# Altium project Longboard_32bit.PrjPCB (part 4 of 6)

## Sheet DC_Power_Regulation.SchDoc: STM32F446 CNC
size B; Author: AM; CompanyName: Expatria Technologies; DrawnBy: A.Marles; Engineer: AM; Organization: Expatria Technolgoies; Address1: PO Box 2084; Address3: Merritt, BC V1K 1B8; Address4: Canada; DocumentNumber: 23; Revision: B6; SheetNumber: 20; SheetTotal: 26
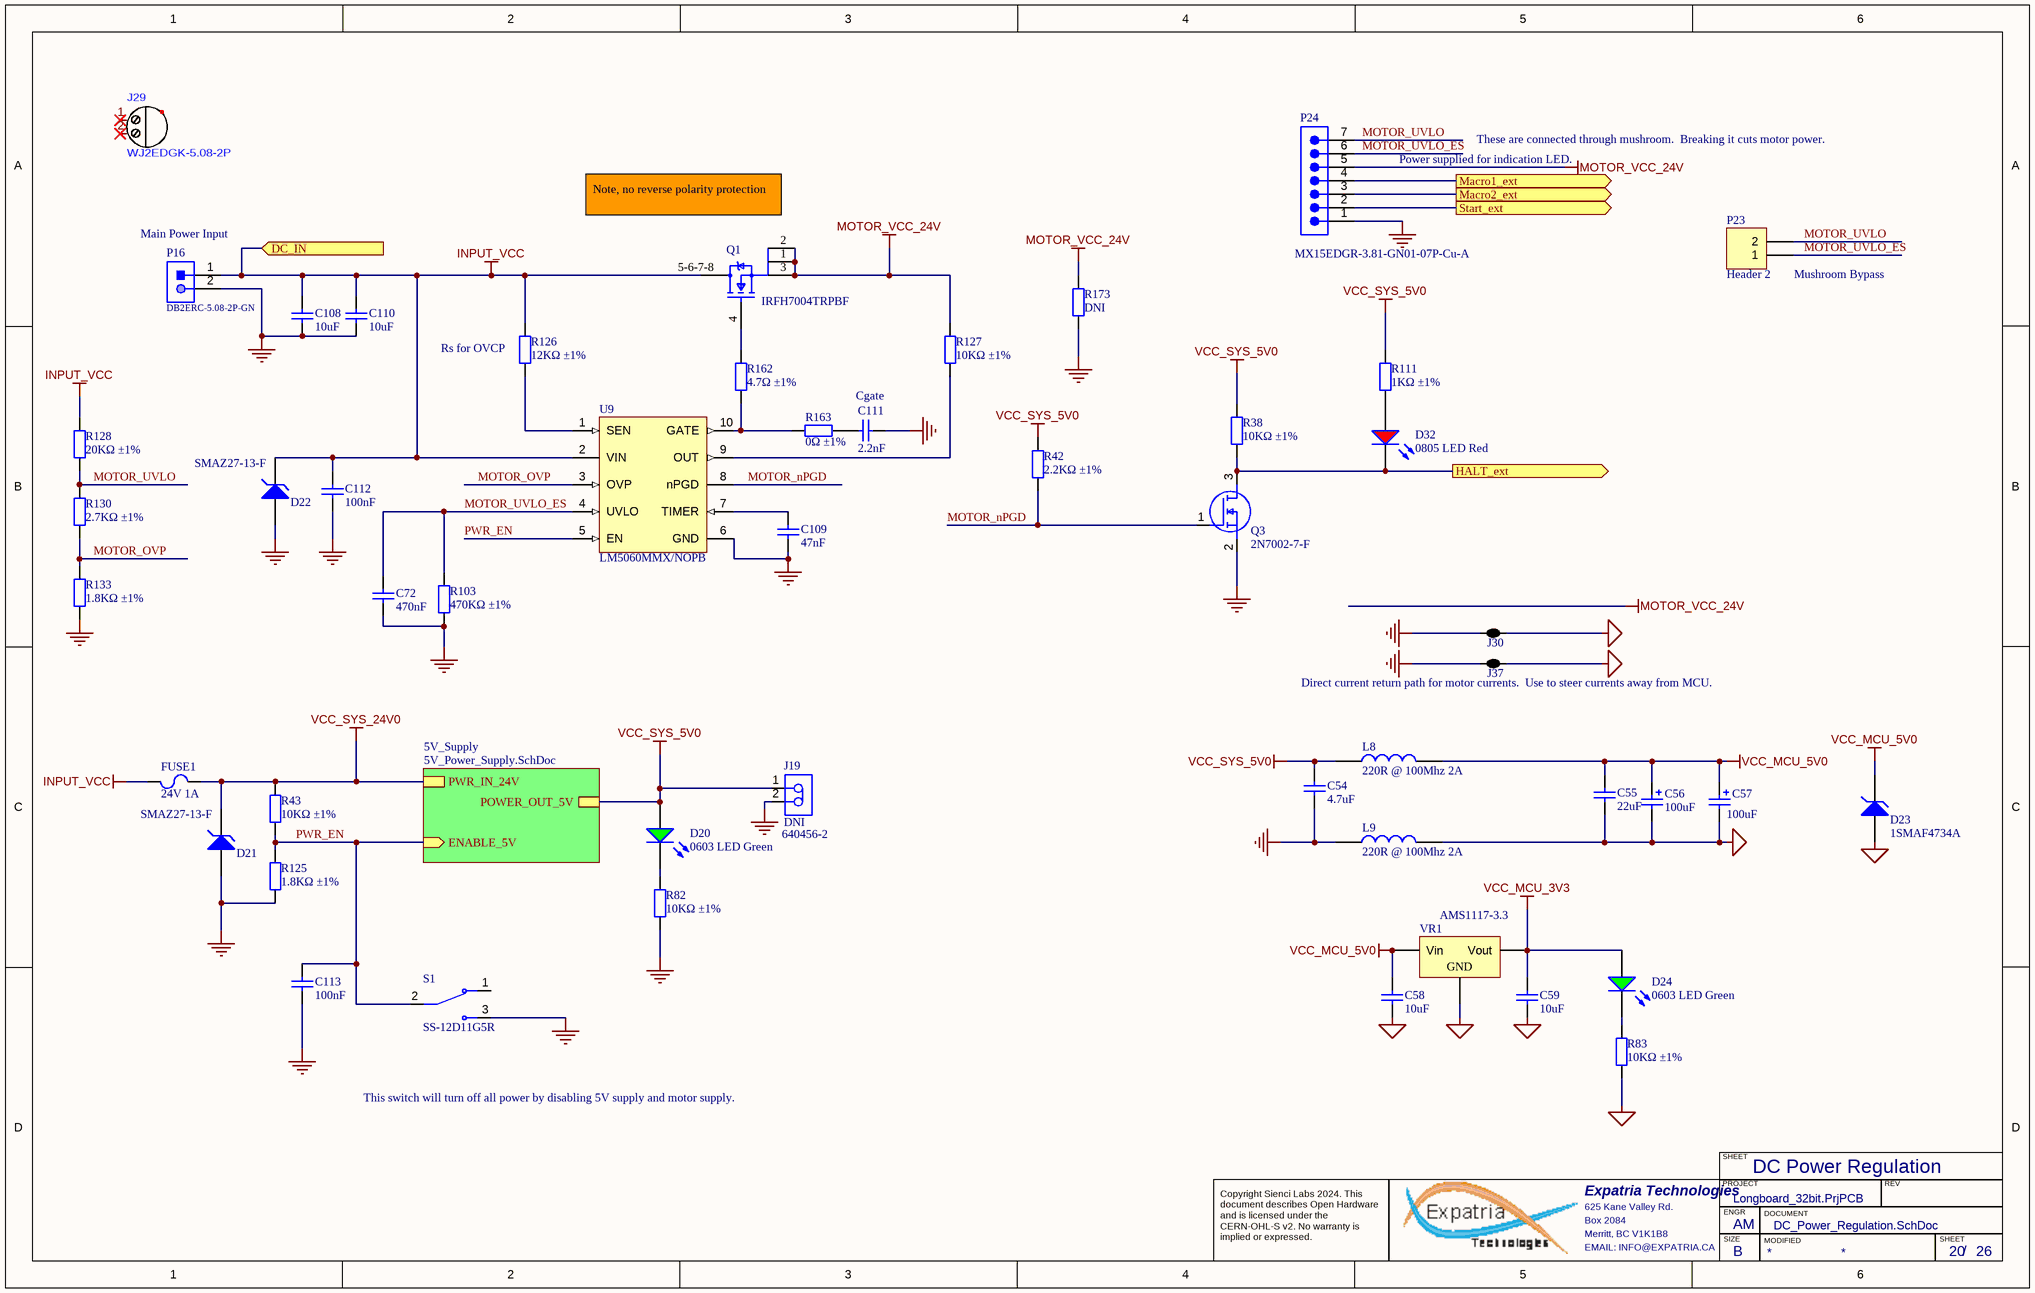
[diagram p12: DC_Power_Regulation.SchDoc]

### Parts
C54  4.7uF  [0603_C]
C55  22uF  [0805_C]
C56  100uF  [CASE-B_3528]
C57  100uF  [WCAP-ASLI_D6.3H7.7]
C58  10uF  [1206_C]
C59  10uF  [1206_C]
C72  470nF  [0603_C]
C108  10uF  [1206_C]
C109  47nF  [0603_C]
C110  10uF  [1206_C]
C111  2.2nF  [0402_C]
C112  100nF  [0603_C]
C113  100nF  [0603_C]
D20  0603 LED Green  [0603_LED_S1 - GREEN]
D21  SMAZ27-13-F  [DIOM5226X240N]
D22  SMAZ27-13-F  [DIOM5226X240N]
D23  1SMAF4734A  [DIOM5226X240N]
D24  0603 LED Green  [0603_LED_S1 - GREEN]
D32  0805 LED Red  [0805_LED_S1 - RED]
FUSE1  24V 1A  [1206_C]
J19  DNI  value 640456-2  [TECO-640456-2_V]
J29  WJ2EDGK-5.08-2P  (mechanical)
J30  2 way net tie junction  [2way_HP]  (value not drawn)  (net tie, no BOM)
J37  2 way net tie junction  [2way_HP]  (value not drawn)  (net tie, no BOM)
L8  220R @ 100Mhz 2A  [0805_R]
L9  220R @ 100Mhz 2A  [0805_R]
P16  DB2ERC-5.08-2P-GN  [CONN-TH_2P-P5.08_DB2ERC-5.08-2P]
P23  Header 2  [HDR1X2]
P24  MX15EDGR-3.81-GN01-07P-Cu-A  [691322310007]
Q1  IRFH7004TRPBF  [FP-PG-TDSON-8-MFG]
Q3  2N7002-7-F  [SOT-23(SOT-23-3)]
R38  10KΩ ±1%  [0603_R]
R42  2.2KΩ ±1%  [0603_R]
R43  10KΩ ±1%  [0603_R]
R82  10KΩ ±1%  [0603_R]
R83  10KΩ ±1%  [0603_R]
R103  470KΩ ±1%  [0603_R]
R111  1KΩ ±1%  [0603_R]
R125  1.8KΩ ±1%  [0603_R]
R126  12KΩ ±1%  [0603_R]
R127  10KΩ ±1%  [0603_R]
R128  20KΩ ±1%  [0603_R]
R130  2.7KΩ ±1%  [0603_R]
R133  1.8KΩ ±1%  [0603_R]
R162  4.7Ω ±1%  [0603_R]
R163  0Ω ±1%  [0603_R]
R173  DNI  [0603_R]  (no BOM)
S1  SS-12D11G5R  [SW_500SSP1S1M6QEA]
U9  LM5060MMX/NOPB  [DGS0010A_N]
VR1  AMS1117-3.3  [SOT-223]

### Sub-sheets
5V_Supply = 5V_Power_Supply.SchDoc: POWER_OUT_5V, PWR_IN_24V, ENABLE_5V (in)

### Ports
DC_IN (in), HALT_ext (out), Macro1_ext (out), Macro2_ext (out), Start_ext (out)

### Nets
GND: C54.1 C72.1 C108.1 C109.1 C110.1 C111.1 C112.1 C113.1 D21.1(A) D22.1(A) J19.2 J30.1 J37.1 L9.1 P16.2 P24.1 Q3.2(S) R82.1 R103.1 R125.1 R133.1 R173.1 S1.3(NO) U9.6(GND)
INPUT_VCC: C108.2 C110.2 C112.2 D22.2(K) FUSE1.1 P16.1 Q1.5-6-7-8(D) R126.2 R128.2 U9.2(VIN) ; port DC_IN
MCU_GND: C55.1 C56.2 C57.2(N) C58.1 C59.1 D23.1(A) J30.2 J37.2 L9.2 R83.1 VR1.1(GND)
MOTOR_VCC_24V: P24.5 Q1.1(S) Q1.2(S) Q1.3(S) R127.2 R173.2
VCC_MCU_3V3: C59.2 D24.A VR1.2(Vout)
VCC_MCU_5V0: C55.2 C56.1 C57.1(P) C58.2 D23.2(K) L8.2 VR1.3(Vin)
VCC_SYS_5V0: C54.2 D20.A J19.1 L8.1 R38.2 R42.2 R111.2 ; sheet 5V_Supply/POWER_OUT_5V
VCC_SYS_24V0: D21.2(K) FUSE1.2 R43.2 ; sheet 5V_Supply/PWR_IN_24V
HALT_ext: D32.K Q3.3(D) R38.1 ; port HALT_ext
Macro1_ext: P24.4 ; port Macro1_ext
Macro2_ext: P24.3 ; port Macro2_ext
MOTOR_nPGD: Q3.1(G) R42.1 U9.8(nPGD)
MOTOR_OVP: R130.1 R133.2 U9.3(OVP)
MOTOR_UVLO: P23.2 P24.7 R128.1 R130.2
MOTOR_UVLO_ES: C72.2 P23.1 P24.6 R103.2 U9.4(UVLO)
PWR_EN: C113.2 R43.1 R125.2 S1.2(COM) U9.5(EN) ; sheet 5V_Supply/ENABLE_5V
Start_ext: P24.2 ; port Start_ext
NetC109_2: C109.2 U9.7(TIMER)
NetC111_2: C111.2 R163.1
NetD20_K: D20.K R82.2
NetD24_K: D24.K R83.2
NetD32_A: D32.A R111.1
NetQ1_4: Q1.4(G) R162.2
NetR126_1: R126.1 U9.1(SEN)
NetR127_1: R127.1 U9.9(OUT)
NetR162_1: R162.1 R163.2 U9.10(GATE)

Not connected (* = marked no-connect by the designer): J29 1* 2*; S1 1(NC)

### Notes on the sheet
- Power supplied for indication LED.
- These are connected through mushroom.  Breaking it cuts motor power.
- (near P16) Main Power Input
- (near Q1) Note, no reverse polarity protection
- (near P23) Mushroom Bypass
- (near R126) Rs for OVCP
- Cgate
- (near J37) Direct current return path for motor currents.  Use to steer currents away from MCU.
- This switch will turn off all power by disabling 5V supply and motor supply.
- DC Power Regulation
- SHEET
- Expatria Technologies
- 625 Kane Valley Rd.
- Box 2084
- Merritt, BC V1K1B8
- PROJECT
- SIZE
- ENGR
- MODIFIED
- DOCUMENT
- REV
- Copyright Sienci Labs 2024. This document describes Open Hardware and is licensed under the CERN-OHL-S v2. No warranty is implied or expressed.
- EMAIL: INFO@EXPATRIA.CA
- B
- /

### Library data of the parts
C54 = 0603 4.7uF (475) 10% 16V: as C124 on sheet Ethernet_Interface; ComponentLink1Description: Supplier link; ComponentLink1URL: http://www.szlcsc.com/product/details_20375.html; Package: 0603; Supplier: LC; SuppliersPartNumber: C19666; Capacitance: 4.7uF; Tolerance: 10%; Voltage: 16V
C55 = 0805 22uF (226) 20% 25V: as C8 on sheet RS485; ComponentLink1Description: Supplier link; ComponentLink1URL: http://www.szlcsc.com/product/details_46786.html; Package: 0805; Supplier: LC; SuppliersPartNumber: C45783; Capacitance: 22uF; Tolerance: 20%; Voltage: 25V
C56 = 3528 100uF (107) 10% 6.3V: Tantalum capacitor; Manufacturer: AVX; PartNumber: TAJB107K006RNJ; Tolerance: 10%; Voltage: 6.3V; ComponentLink1Description: Supplier link; ComponentLink1URL: http://www.szlcsc.com/product/details_16815.html; Package: 3528; Supplier: LCSC; SuppliersPartNumber: C16133; Capacitance: 100uF; Manufacturer Part Number: TAJB107K006RNJ
C57 = 865080445010: -45℃~+105℃ 2000hrs@105℃ 100uF 7.7mm 35V 6.3mm ±20% SMD,6.3x7.7mm Aluminum Electrolytic Capacitors - SMD ROHS; Manufacturer: Capxon International Elec; Manufacturer Part Number: HV101M035E077ETR; SuppliersPartNumber: C59934; Value: 100uF; Supplier: LCSC
C58 C59 C108 C110 = 1206 10uF (106) 10% 50V: 50V 10uF X5R ±10% 1206 Multilayer Ceramic Capacitors MLCC - SMD/SMT ROHS; Manufacturer: Samsung Electro-Mechanics; Manufacturer Part Number: CL31A106KBHNNNE; Package: 1206; Supplier: LC; SuppliersPartNumber: C13585; Capacitance: 10uF; Tolerance: 10%; Voltage: 50V
C72 = 0603 470nF (474) 10% 25V: Chip capacitors; Manufacturer: Samsung Electro-Mechanics; PartNumber: CL10B474KA8NNNC; Tolerance: 10%; Voltage: 25V; ComponentLink1Description: Supplier link; ComponentLink1URL: http://www.szlcsc.com/product/details_1975.html; Package: 0603; Supplier: LC; SuppliersPartNumber: C1623; Capacitance: 470nF
C109 = 0603 47nF (473) 10% 50V: Chip capacitors; Manufacturer: Samsung Electro-Mechanics; PartNumber: CL10B473KB8NNNC; Tolerance: 10%; Voltage: 50V; ComponentLink1Description: Supplier link; ComponentLink1URL: http://www.szlcsc.com/product/details_1974.html; Package: 0603; Supplier: LC; SuppliersPartNumber: C1622; Capacitance: 47nF
C111 = 0402 2.2nF (222) 10% 50V: Chip capacitor; Manufacturer: Guangdong Fenghua Advanced Tech; PartNumber: 0402B222K500NT; Tolerance: 10%; Voltage: 50V; ComponentLink1Description: Supplier link; ComponentLink1URL: http://www.szlcsc.com/product/details_1883.html; Package: 0402; Supplier: LC; SuppliersPartNumber: C1531; Capacitance: 2.2nF
C112 C113 = 0603 100nF (104) 10% 50V: as C4 on sheet Spindle_Control; ComponentLink1Description: Supplier link; ComponentLink1URL: http://www.szlcsc.com/product/details_15331.html; Package: 0603; Supplier: LC; SuppliersPartNumber: C14663; Capacitance: 100nF; Tolerance: 10%; Voltage: 50V
D20 D24 = 19-217/GHC-YR1S2/3T: as D18 on sheet RS485; Package: 0603; Supplier: LC; SuppliersPartNumber: C72043; Color: Green; Manufacturer Part Number: 19-217/GHC-YR1S2/3T
D21 D22 = BZT52C27: 27V ±5% 1W 500nA @ 20.5V SMA(DO-214AC) Zener Diodes RoHS; Manufacturer: Diodes Incorporated; ComponentLink1Description: 供应商链接; ComponentLink1URL: http://www.szlcsc.com/product/details_8541.html; Package: SMA(DO-214AC); Supplier: LCSC; SuppliersPartNumber: C155318; Manufacturer Part Number: SMAZ27-13-F
D23 = BZT52C27: 27V ±5% 1W 500nA @ 20.5V SMA(DO-214AC) Zener Diodes RoHS; Manufacturer: Shandong Jingdao Microelectronics; ComponentLink1Description: 供应商链接; ComponentLink1URL: http://www.szlcsc.com/product/details_8541.html; Package: SMAF; Supplier: LCSC; SuppliersPartNumber: C169539; Manufacturer Part Number: 1SMAF4734A
D32 = 0805 LED Red: Red 0805 Light Emitting Diodes (LED) ROHS; Manufacturer: Foshan NationStar Optoelectronics; Manufacturer Part Number: NCD0805R1; Package: 0805; Supplier: LC; SuppliersPartNumber: C84256; Color: Red
FUSE1 = JK-nSMD050-24: 24V 1A 0.1s 1206 PTC Resettable Fuses RoHS; Manufacturer: Jinrui Electronic Materials Co.; Package: 1206; Supplier: LCSC; SuppliersPartNumber: C369160; PartNumber: JK-nSMD050-24; Manufacturer Part Number: JK-nSMD050-24
J19 = CMP-2000-05417-1: Male Header, Pitch 2.54 mm, 1 x 2 Position, Height 10.49 mm, Tail Length 3.556 mm, -55 to 105 degC, RoHS, Bulk; Manufacturer: TE Connectivity; Standards: RoHSCompliant,ELVCompliant,UL94V-0; Material, Housing: Polyester; Agency Approvals: CSA,UL; Brand/Series: MTA-100Series; Contact Centerline Spacing: 0.100 / in.; Material, Contact: CopperAlloy; Current, Rating: 5 / A; Color, Housing: White; Contact Termination Area Plating: Tin; Special Features: Pinstrip; Number of Positions: 2; Pin Spacing: 0.1 / "; Temperature, Operating: -55to+105 / degC; Angle: Straight; Mount Angle: Vertical; Connector Type: MTA-100; Primary Type: InterconnectSystem; Voltage, Rating: 250 / V; Mounting Hole Size: 0.04 / "; Number of Rows: 1; Termination: Solder; Length, Terminal Post: 0.14 / in.; Manufacturer URL: http://www.te.com/; Color: White; Size, Post: 0.025 / in.; Contact Shape: Square; Mounting Type: PCMount; Datasheet URL: https://datasheet.ciiva.com/11746/0900766b80eb7fdd-11746365.pdf; Type: PCBPlug; Datasheet Version: Rev. W, 06/2004; Number of Contacts: 2; Flammability Rating: UL94V-0; Contact Plating: Tin; Length, Pin: 0.14 / "; Contact Mating Area Plating: Tin; Length, Overall: 0.2 / "; SuppliersPartNumber: C86502
J29 = WJ2EDGK-5.08-2P: 5.08mm Green Plug P=5.08mm Pluggable System Terminal Block ROHS; Manufacturer: Kangnex; Supplier: LCSC; Supplier Part Number 1: C71370; Manufacturer Part Number: WJ2EDGK-5.08-2P; RoHS: No; SuppliersPartNumber: C71370
J30 J37 = 2way: ComponentLink1URL: http://www.edatools.cz/addons; ComponentLink1Description: Source; FootprintNote: LP=12mil, MP=40mil, HP=120mil
L8 L9 = CBW201209U221T: as L6 on sheet Ethernet_Interface; Manufacturer Part Number: CBW201209U221T; Package: 0402; Supplier: LC; SuppliersPartNumber: C139188
P16 = DB2ERC-5.08-2P-GN: 320V 20A 2 Bend -40℃~+105℃ 1 5.08mm 1x2P Green Board Edge/Receptacle-Close Push-Pull,P=5.08mm Pluggable System Terminal Block ROHS; Manufacturer: Dibo; Supplier 1: LCSC; Supplier Part Number 1: C395737; Manufacturer Part Number: DB2ERC-5.08-2P-GN; RoHS: Yes; Category: Terminals; SuppliersPartNumber: C395737
P23 = Header 2: Straight Square Pins 2 2.54mm Black Brass 1x2P Plugin,P=2.54mm Pin Headers ROHS; Manufacturer: MOLEX; Manufacturer Part Number: 22284020; Publisher: Altium Limited; LatestRevisionDate: 17-Jul-2002; LatestRevisionNote: Re-released for DXP Platform.; SuppliersPartNumber: C234182; Supplier 1: LCSC; Supplier Part Number 1: C234182
P24 = MX15EDGR-3.81-GN01-07P-Cu-A: 300V 8A 7 Bend -40℃~+105℃ 1 3.81mm 1x7P Green Board Edge/Receptacle-Close Push-Pull,P=3.81mm Pluggable System Terminal Block ROHS; Manufacturer: MAX; Manufacturer Part Number: MX15EDGR-3.81-GN01-07P-Cu-A; SuppliersPartNumber: C5188162
Q1 = IRFH7004TRPBF: MOSFET N-CH 40V 100A 8PQFN; Rds On Max: 1.4mR; Threshold Voltage: 3V; Input Capacitance: 6.419nF; Max Power Dissipation: 156W; SuppliersPartNumber: C112334; Max Operating Temperature: 150°C; Min Operating Temperature: -55°C; Case/Package: VQFN; Packaging: Cut Tape; RoHS Compliant: Yes; Continuous Drain Current (ID): 100A; Reach SVHC Compliant: Yes; Number of Pins: 5; Mount: Surface Mount; Lead Free: Lead Free; Series: HEXFET®, StrongIRFET™; Max Dual Supply Voltage: 40V; Halogen Free: Halogen Free; Drain to Source Voltage (Vdss): 40V
Q3 = 2N7002-7-F: as Q4 on sheet Spindle_Control; SuppliersPartNumber: C85049; Manufacturer Part Number: 2N7002-7-F; Value: 2N7002-7-F; Datasheet Link: https://datasheet.datasheetarchive.com/originals/distributors/SFDatasheet-0/sf-0003625.pdf; Height: 1.2mm; Manufacturer_Part_Number: 2N7002-7-F; Mouser Part Number: 621-2N7002-F; Mouser Price/Stock: https://www.mouser.co.uk/ProductDetail/Diodes-Incorporated/2N7002-7-F?qs=jMXWnm70%252BC%252BAX%252BMLzUkTZg%3D%3D; Arrow Part Number: 2N7002-7-F; Arrow Price/Stock: https://www.arrow.com/en/products/2n7002-7-f/diodes-incorporated?region=nac
R38 R43 R82 R83 R127 = 0603 10K (1002) 1%: Chip resistor; Manufacturer: Uniroyal Elec; PartNumber: 0603WAF1002T5E; Power: 1/10W; ComponentLink1Description: Supplier link; ComponentLink1URL: http://www.szlcsc.com/product/details_26547.html; Package: 0603; SuppliersPartNumber: C25804; Resistance: 10KΩ; Tolerance: 1%
  R38: Supplier: LC; Manufacturer Part Number: 0603WAF1002T5E
  R43 R82 R83: Supplier: LCSC; Manufacturer Part Number: 0603WAF1002T5E
  R127: Supplier: LC
R42 = 0603 2.2K (2201) 1%: Chip resistor; Manufacturer: Uniroyal Elec; PartNumber: 0603WAF2201T5E; Power: 1/10W; ComponentLink1Description: Supplier link; ComponentLink1URL: http://www.szlcsc.com/product/details_4597.html; Package: 0603; Supplier: LC; SuppliersPartNumber: C4190; Resistance: 2.2KΩ; Tolerance: 1%; Manufacturer Part Number: 0603WAF2201T5E
R103 = 0603 470K (4703) 1%: Chip resistor; Manufacturer: Uniroyal Elec; PartNumber: 0603WAF4703T5E; Power: 1/10W; ComponentLink1Description: Supplier link; ComponentLink1URL: http://www.szlcsc.com/product/details_23905.html; Package: 0603; Supplier: LC; SuppliersPartNumber: C23178; Resistance: 470KΩ; Tolerance: 1%
R111 = 0603 1K (1001) 1%: Chip resistor; Manufacturer: Uniroyal Elec; PartNumber: 0603WAF1001T5E; Power: 1/10W; ComponentLink1Description: Supplier link; ComponentLink1URL: http://www.szlcsc.com/product/details_21904.html; Package: 0603; Supplier: LC; SuppliersPartNumber: C21190; Resistance: 1KΩ; Tolerance: 1%; Manufacturer Part Number: 0603WAF1001T5E
R125 R133 = 0603 1.8K (1801) 1%: Chip resistor; Manufacturer: Uniroyal Elec; PartNumber: 0603WAF1801T5E; Power: 1/10W; ComponentLink1Description: Supplier link; ComponentLink1URL: http://www.szlcsc.com/product/details_4584.html; Package: 0603; Supplier: LC; SuppliersPartNumber: C4177; Resistance: 1.8KΩ; Tolerance: 1%
  R125: Manufacturer Part Number: 0603WAF1801T5E
R126 = 0603 12K (1202) 1%: Chip resistor; Manufacturer: Uniroyal Elec; PartNumber: 0603WAF1202T5E; Power: 1/10W; ComponentLink1Description: Supplier link; ComponentLink1URL: http://www.szlcsc.com/product/details_23517.html; Package: 0603; Supplier: LC; SuppliersPartNumber: C22790; Resistance: 12KΩ; Tolerance: 1%
R128 = 0603 20K (2002) 1%: Chip resistor; Manufacturer: Uniroyal Elec; PartNumber: 0603WAF2002T5E; Power: 1/10W; ComponentLink1Description: Supplier link; ComponentLink1URL: http://www.szlcsc.com/product/details_4591.html; Package: 0603; Supplier: LC; SuppliersPartNumber: C4184; Resistance: 20KΩ; Tolerance: 1%
R130 = 0603 2.7K (2701) 1%: Chip resistor; Manufacturer: Uniroyal Elec; PartNumber: 0603WAF2701T5E; Power: 1/10W; ComponentLink1Description: Supplier link; ComponentLink1URL: http://www.szlcsc.com/product/details_13814.html; Package: 0603; Supplier: LC; SuppliersPartNumber: C13167; Resistance: 2.7KΩ; Tolerance: 1%
R162 = 0603 4.7R (4R70) 1%: Chip resistor; Manufacturer: Uniroyal Elec; PartNumber: 0603WAF470KT5E; Power: 1/10W; ComponentLink1Description: Supplier link; ComponentLink1URL: http://www.szlcsc.com/product/details_23891.html; Package: 0603; Supplier: LC; SuppliersPartNumber: C23164; Resistance: 4.7Ω; Tolerance: 1%; Manufacturer Part Number: 0603WAF470KT5E
R163 = 0603 0R (0R0) 1%: Chip resistor; Manufacturer: Uniroyal Elec; PartNumber: 0603WAF0000T5E; Power: 1/10W; ComponentLink1Description: Supplier link; ComponentLink1URL: http://www.szlcsc.com/product/details_21903.html; Package: 0603; Supplier: LC; SuppliersPartNumber: C21189; Resistance: 0Ω; Tolerance: 1%; Manufacturer Part Number: 0603WAF0000T5E
R173 = 0603 10K (1002) 1%: Chip resistor; Manufacturer: Uniroyal Elec; PartNumber: 0603WAF1002T5E; Power: 1/10W; Resistance: 10KΩ; Tolerance: 1%; ComponentLink1Description: Supplier link; ComponentLink1URL: http://www.szlcsc.com/product/details_26547.html; Package: 0603; Supplier: LCSC; SuppliersPartNumber: C25804; Manufacturer Part Number: 0603WAF1002T5E
S1 = SS-12D11G5R: Shrouded 5A SPDT 125V 125V 5A 10000次 Black Plugin Slide Switches ROHS; Manufacturer: XKB Connectivity; SuppliersPartNumber: C388633; Manufacturer Part Number: SS-12D11G5R
U9 = LM5060MMX/NOPB: High-Side Protection Controller with Low Quiescent Current, Standard Grade, 10-pin Mini SOIC, 3500 Reel; Manufacturer: TI National Semiconductor; PackageTopMarking: ZXTT*SXAB; High-Reliability: Y; CompType: Switcher; PartNumber: LM5060MMX/NOPB; ComponentLink1Description: Datasheet URL; ComponentLink1URL: http://www.ti.com/general/docs/lit/getliterature.tsp?genericPartNumber=LM5060&fileType=pdf; Code_JEDEC: MO-187-BA; PackageReference: DGS0010A; PowerWise: Y; PackageDescription: Mini-SO, Molded, .118 x .118 x .034in Body, 10 Lead, .0197in Pitch; RoHS: Y; PinCount: 10; Manufacturer Part Number: LM5060MMX/NOPB; SuppliersPartNumber: C2676940
VR1 = SOT-223 AMS1117-3.3: Vout=3.3V 1A 72dB@(120Hz) (LDO); Manufacturer 1: AMS; ComponentLink1Description: 供应商链接; ComponentLink1URL: http://www.szlcsc.com/product/details_6652.html; Package: SOT-223; Supplier: LCSC; SuppliersPartNumber: C6186; Manufacturer Part Number 1: AMS1117-3.3; Manufacturer: AMS; Manufacturer Part Number: AMS1117-3.3

## Sheet 5V_Power_Supply.SchDoc: STM32F446 CNC
size B; Author: AM; CompanyName: Expatria Technologies; DrawnBy: A.Marles; Engineer: AM; Organization: Expatria Technolgoies; Address1: PO Box 2084; Address3: Merritt, BC V1K 1B8; Address4: Canada; DocumentNumber: 24; Revision: B6; SheetNumber: 21; SheetTotal: 26
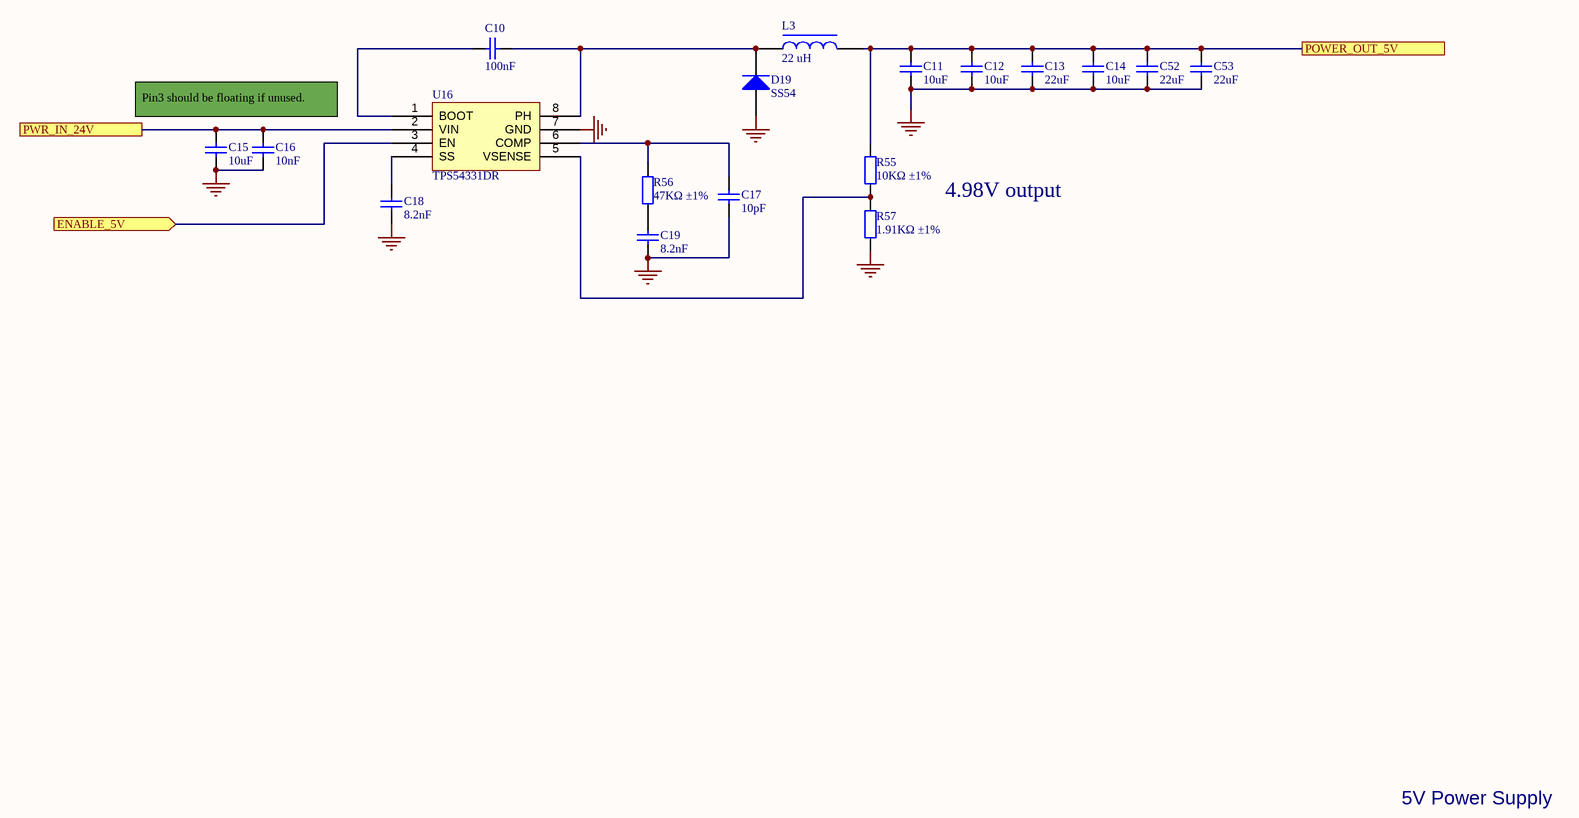
[diagram p13: 5V_Power_Supply.SchDoc]

### Parts
C10  100nF  [0603_C]
C11  10uF  [1206_C]
C12  10uF  [1206_C]
C13  22uF  [0805_C]
C14  10uF  [1206_C]
C15  10uF  [1206_C]
C16  10nF  [0603_C]
C17  10pF  [0603_C]
C18  8.2nF  [0603_C]
C19  8.2nF  [0603_C]
C52  22uF  [0805_C]
C53  22uF  [0805_C]
D19  SS54  [SMA(DO-214AC)_S1]
L3  22 uH  [INDPM7366X300N]
R55  10KΩ ±1%  [0603_R]
R56  47KΩ ±1%  [0603_R]
R57  1.91KΩ ±1%  [0603_R]
U16  TPS54331DR  [SOIC-8_150mil]

### Ports
ENABLE_5V (in), POWER_OUT_5V, PWR_IN_24V

### Nets
GND: C11.1 C12.1 C13.1 C14.1 C15.1 C16.1 C17.1 C18.1 C19.1 C52.1 C53.1 D19.1(A) R57.1 U16.7(GND)
VCC_SYS_5V0: C11.2 C12.2 C13.2 C14.2 C52.2 C53.2 L3.2 R55.2 ; port POWER_OUT_5V
VCC_SYS_24V0: C15.2 C16.2 U16.2(VIN) ; port PWR_IN_24V
PWR_EN: U16.3(EN) ; port ENABLE_5V
NetC10_1: C10.1 U16.1(BOOT)
NetC10_2: C10.2 D19.2(K) L3.1 U16.8(PH)
NetC17_2: C17.2 R56.2 U16.6(COMP)
NetC18_2: C18.2 U16.4(SS)
NetC19_2: C19.2 R56.1
NetR55_1: R55.1 R57.2 U16.5(VSENSE)

### Notes on the sheet
- Pin3 should be floating if unused.
- 4.98V output
- 5V Power Supply
- SHEET
- Expatria Technologies
- 625 Kane Valley Rd.
- Box 2084
- Merritt, BC V1K1B8
- PROJECT
- SIZE
- ENGR
- MODIFIED
- DOCUMENT
- REV
- Copyright Sienci Labs 2024. This document describes Open Hardware and is licensed under the CERN-OHL-S v2. No warranty is implied or expressed.
- EMAIL: INFO@EXPATRIA.CA
- B
- /

### Library data of the parts
C10 = 0603 100nF (104) 10% 50V: as C4 on sheet Spindle_Control; Package: 0603; Supplier: LC; SuppliersPartNumber: C14663; Capacitance: 100nF; Tolerance: 10%; Voltage: 50V; ComponentLink1Description: Supplier link; ComponentLink1URL: http://www.szlcsc.com/product/details_15331.html
C11 C12 C14 C15 = 1206 10uF (106) 10% 50V: as C58 on sheet DC_Power_Regulation; Package: 1206; Supplier: LC; SuppliersPartNumber: C13585; Capacitance: 10uF; Tolerance: 10%; Voltage: 50V
C13 C52 C53 = 0805 22uF (226) 20% 25V: as C8 on sheet RS485; Package: 0805; Supplier: LC; SuppliersPartNumber: C45783; Capacitance: 22uF; Tolerance: 20%; Voltage: 25V; ComponentLink1Description: Supplier link; ComponentLink1URL: http://www.szlcsc.com/product/details_46786.html
C16 = 0603 10nF (103) 10% 50V: 50V 10nF X7R ±10% 0603 Multilayer Ceramic Capacitors MLCC - SMD/SMT ROHS; Manufacturer: Guangdong Fenghua Advanced Tech; Manufacturer Part Number: 0603B103K500NT; Package: 0603; Supplier: LC; SuppliersPartNumber: C57112; Capacitance: 10nF; Tolerance: 10%; Voltage: 50V; ComponentLink1Description: Supplier link; ComponentLink1URL: http://www.szlcsc.com/product/details_58143.html
C17 = 0603 10pF (100) 5% 50V: Chip capacitors; Manufacturer: Samsung Electro-Mechanics; Manufacturer Part Number: CL10C100JB8NNNC; Tolerance: 5%; Voltage: 50V; Package: 0603; Supplier: LCSC; SuppliersPartNumber: C1634; Capacitance: 10pF; ComponentLink1Description: Supplier link; ComponentLink1URL: http://www.szlcsc.com/product/details_1986.html
C18 C19 = 0603 8.2nF (822) 10% 50V: 50V 8.2nF X7R ±10% 0603 Multilayer Ceramic Capacitors MLCC - SMD/SMT ROHS; Manufacturer: YAGEO; Manufacturer Part Number: CC0603KRX7R9BB822; Package: 0603; Supplier: LC; SuppliersPartNumber: C113812; Capacitance: 8.2nF; Tolerance: 10%; Voltage: 50V; Manufacturer 1: YAGEO; Manufacturer Part Number 1: CC0603KRX7R9BB822; Value: 8.2nF
D19 = SMA(DO-214AC) SS54: 40V 5A 550mV@5A; Manufacturer 1: MDD; Package: SMA(DO-214AC); Supplier: LCSC; SuppliersPartNumber: C22452; Manufacturer Part Number 1: SS54; Manufacturer: MDD; Manufacturer Part Number: SS54
L3 = 1206 10uH 10%: 3A 22uH ±20% 130mΩ SMD,7.1x6.6x3mm Power Inductors ROHS; Manufacturer: YJYCOIN; Manufacturer Part Number: YSPI0630A-220M; Package: SMD,7.1x6.6x3mm; Supplier: LCSC; SuppliersPartNumber: C497873
R55 = 0603 10K (1002) 1%: Chip resistor; Manufacturer: Uniroyal Elec; Manufacturer Part Number: 0603WAF1002T5E; Power: 1/10W; Package: 0603; Supplier: LCSC; SuppliersPartNumber: C25804; Resistance: 10KΩ; Tolerance: 1%; ComponentLink1Description: Supplier link; ComponentLink1URL: http://www.szlcsc.com/product/details_26547.html
R56 = 0603 47K (4702) 1%: Chip resistor; Manufacturer: Uniroyal Elec; Manufacturer Part Number: 0603WAF4702T5E; Power: 1/10W; Package: 0603; Supplier: LCSC; SuppliersPartNumber: C25819; Resistance: 47KΩ; Tolerance: 1%; ComponentLink1Description: Supplier link; ComponentLink1URL: http://www.szlcsc.com/product/details_26562.html
R57 = 0603 1.91K (2001) 1%: Chip resistor; Manufacturer: TyoHM; PartNumber: RMC06031.91K1%N; Power: 1/10W; Package: 0603; Supplier: LC; SuppliersPartNumber: C325662; Resistance: 1.91KΩ; Tolerance: 1%; ComponentLink1Description: Supplier link; ComponentLink1URL: http://www.szlcsc.com/product/details_23702.html
U16 = TPS54331DR_[C9865]: Switching Voltage Regulators 3A 28V In Step Down SWIFT DC/DC Cnvrtr; Manufacturer: Texas Instruments; Package: SOIC-8_150mil; Supplier: LCSC; SuppliersPartNumber: C9865; Manufacturer Part Number: TPS54331DR

## Sheet Stepper_driver_group.SchDoc: STM32F446 CNC
size C; Author: AM; CompanyName: Expatria Technologies; DrawnBy: A.Marles; Engineer: AM; Organization: Expatria Technolgoies; Address1: PO Box 2084; Address3: Merritt, BC V1K 1B8; Address4: Canada; DocumentNumber: 11; Revision: B6; SheetNumber: 8; SheetTotal: 26
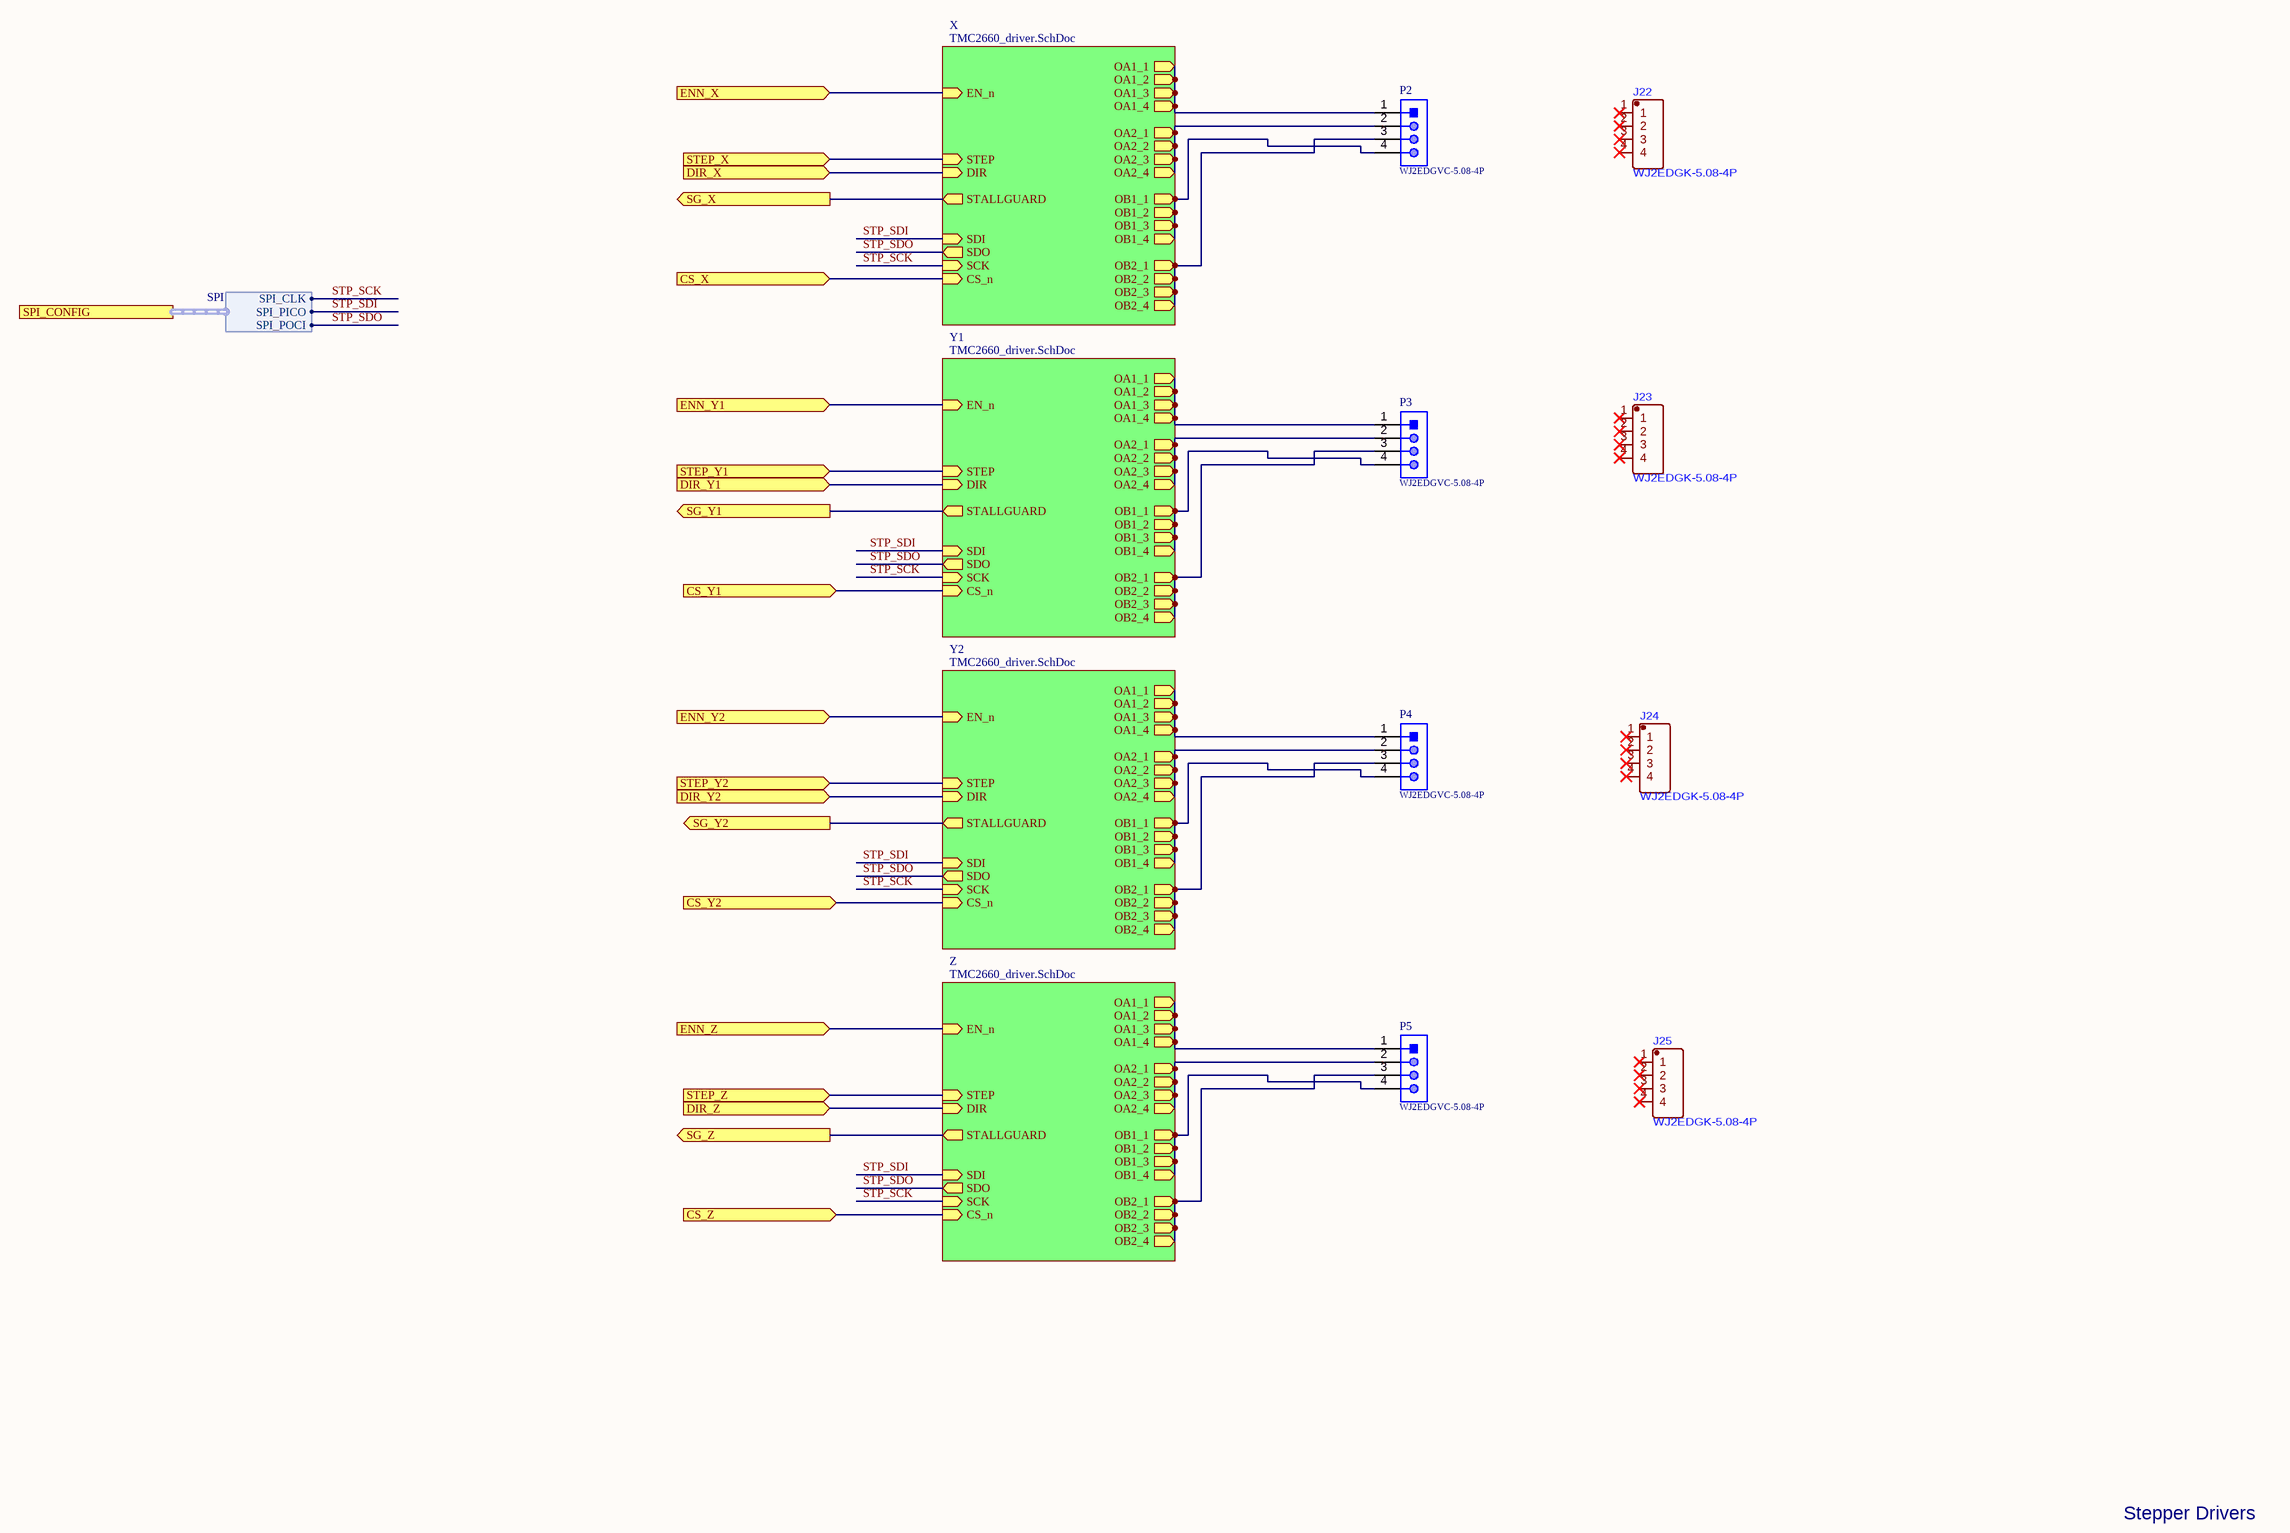
[diagram p14: Stepper_driver_group.SchDoc]

### Parts
J22  WJ2EDGK-5.08-4P  (mechanical)
J23  WJ2EDGK-5.08-4P  (mechanical)
J24  WJ2EDGK-5.08-4P  (mechanical)
J25  WJ2EDGK-5.08-4P  (mechanical)
P2  WJ2EDGVC-5.08-4P  [WJ2EDGVC-5.08-4P]
P3  WJ2EDGVC-5.08-4P  [WJ2EDGVC-5.08-4P]
P4  WJ2EDGVC-5.08-4P  [WJ2EDGVC-5.08-4P]
P5  WJ2EDGVC-5.08-4P  [WJ2EDGVC-5.08-4P]

### Sub-sheets
X = TMC2660_driver.SchDoc: SCK (in), OA2_4 (out), EN_n (in), OB1_1 (out), OA1_2 (out), OB2_3 (out), STEP (in), OB2_1 (out), OB1_4 (out), DIR (in), STALLGUARD (out), SDI (in), SDO (out), OA1_1 (out), OB2_4 (out), OA2_1 (out), OB1_2 (out), OA1_3 (out), OB1_3 (out), OB2_2 (out), OA2_2 (out), OA1_4 (out), OA2_3 (out), CS_n (in)
Y1 = TMC2660_driver.SchDoc: SCK (in), OA2_4 (out), EN_n (in), OB1_1 (out), OA1_2 (out), OB2_3 (out), STEP (in), OB2_1 (out), OB1_4 (out), DIR (in), STALLGUARD (out), SDI (in), SDO (out), OA1_1 (out), OB2_4 (out), OA2_1 (out), OB1_2 (out), OA1_3 (out), OB1_3 (out), OB2_2 (out), OA2_2 (out), OA1_4 (out), OA2_3 (out), CS_n (in)
Y2 = TMC2660_driver.SchDoc: SCK (in), OA2_4 (out), EN_n (in), OB1_1 (out), OA1_2 (out), OB2_3 (out), STEP (in), OB2_1 (out), OB1_4 (out), DIR (in), STALLGUARD (out), SDI (in), SDO (out), OA1_1 (out), OB2_4 (out), OA2_1 (out), OB1_2 (out), OA1_3 (out), OB1_3 (out), OB2_2 (out), OA2_2 (out), OA1_4 (out), OA2_3 (out), CS_n (in)
Z = TMC2660_driver.SchDoc: SCK (in), OA2_4 (out), EN_n (in), OB1_1 (out), OA1_2 (out), OB2_3 (out), STEP (in), OB2_1 (out), OB1_4 (out), DIR (in), STALLGUARD (out), SDI (in), SDO (out), OA1_1 (out), OB2_4 (out), OA2_1 (out), OB1_2 (out), OA1_3 (out), OB1_3 (out), OB2_2 (out), OA2_2 (out), OA1_4 (out), OA2_3 (out), CS_n (in)

### Ports
CS_X (in), CS_Y1 (in), CS_Y2 (in), CS_Z (in), DIR_X (in), DIR_Y1 (in), DIR_Y2 (in), DIR_Z (in), ENN_X (in), ENN_Y1 (in), ENN_Y2 (in), ENN_Z (in), SG_X (out), SG_Y1 (out), SG_Y2 (out), SG_Z (out), SPI_CONFIG (harness SPI), STEP_X (in), STEP_Y1 (in), STEP_Y2 (in), STEP_Z (in)

### Harnesses
SPI: SPI_CLK, SPI_PICO, SPI_POCI

### Nets
CS_X: port CS_X, sheet X/CS_n
CS_Y1: port CS_Y1, sheet Y1/CS_n
CS_Y2: port CS_Y2, sheet Y2/CS_n
CS_Z: port CS_Z, sheet Z/CS_n
DIR_X: port DIR_X, sheet X/DIR
DIR_Y1: port DIR_Y1, sheet Y1/DIR
DIR_Y2: port DIR_Y2, sheet Y2/DIR
DIR_Z: port DIR_Z, sheet Z/DIR
OA1_1: P2.1 ; sheet X/OA1_2, sheet X/OA1_1, sheet X/OA1_3, sheet X/OA1_4
OA1_1: P3.1 ; sheet Y1/OA1_2, sheet Y1/OA1_1, sheet Y1/OA1_3, sheet Y1/OA1_4  [a separate net that carries the same name]
OA1_1: P4.1 ; sheet Y2/OA1_2, sheet Y2/OA1_1, sheet Y2/OA1_3, sheet Y2/OA1_4  [a separate net that carries the same name]
OA1_1: P5.1 ; sheet Z/OA1_2, sheet Z/OA1_1, sheet Z/OA1_3, sheet Z/OA1_4  [a separate net that carries the same name]
OA2_1: P2.2 ; sheet X/OA2_4, sheet X/OA2_1, sheet X/OA2_2, sheet X/OA2_3
OA2_1: P3.2 ; sheet Y1/OA2_4, sheet Y1/OA2_1, sheet Y1/OA2_2, sheet Y1/OA2_3  [a separate net that carries the same name]
OA2_1: P4.2 ; sheet Y2/OA2_4, sheet Y2/OA2_1, sheet Y2/OA2_2, sheet Y2/OA2_3  [a separate net that carries the same name]
OA2_1: P5.2 ; sheet Z/OA2_4, sheet Z/OA2_1, sheet Z/OA2_2, sheet Z/OA2_3  [a separate net that carries the same name]
OB1_1: P2.4 ; sheet X/OB1_1, sheet X/OB1_4, sheet X/OB1_2, sheet X/OB1_3
OB1_1: P3.4 ; sheet Y1/OB1_1, sheet Y1/OB1_4, sheet Y1/OB1_2, sheet Y1/OB1_3  [a separate net that carries the same name]
OB1_1: P4.4 ; sheet Y2/OB1_1, sheet Y2/OB1_4, sheet Y2/OB1_2, sheet Y2/OB1_3  [a separate net that carries the same name]
OB1_1: P5.4 ; sheet Z/OB1_1, sheet Z/OB1_4, sheet Z/OB1_2, sheet Z/OB1_3  [a separate net that carries the same name]
OB2_1: P2.3 ; sheet X/OB2_3, sheet X/OB2_1, sheet X/OB2_4, sheet X/OB2_2
OB2_1: P3.3 ; sheet Y1/OB2_3, sheet Y1/OB2_1, sheet Y1/OB2_4, sheet Y1/OB2_2  [a separate net that carries the same name]
OB2_1: P4.3 ; sheet Y2/OB2_3, sheet Y2/OB2_1, sheet Y2/OB2_4, sheet Y2/OB2_2  [a separate net that carries the same name]
OB2_1: P5.3 ; sheet Z/OB2_3, sheet Z/OB2_1, sheet Z/OB2_4, sheet Z/OB2_2  [a separate net that carries the same name]
SG_X: port SG_X, sheet X/STALLGUARD
SG_Y1: port SG_Y1, sheet Y1/STALLGUARD
SG_Y2: port SG_Y2, sheet Y2/STALLGUARD
SG_Z: port SG_Z, sheet Z/STALLGUARD
STEP_EN_X: port ENN_X, sheet X/EN_n
STEP_EN_YY: port ENN_Y1, port ENN_Y2, sheet Y1/EN_n, sheet Y2/EN_n
STEP_EN_Z: port ENN_Z, sheet Z/EN_n
STEP_X: port STEP_X, sheet X/STEP
STEP_Y1: port STEP_Y1, sheet Y1/STEP
STEP_Y2: port STEP_Y2, sheet Y2/STEP
STEP_Z: port STEP_Z, sheet Z/STEP
STP_SCK: sheet X/SCK, sheet Y1/SCK, sheet Y2/SCK, sheet Z/SCK, port SPI_CONFIG.SPI_CLK  [project net SPI2_CK]
STP_SDI: sheet X/SDI, sheet Y1/SDI, sheet Y2/SDI, sheet Z/SDI, port SPI_CONFIG.SPI_PICO  [project net SPI2_MOSI]
STP_SDO: sheet X/SDO, sheet Y1/SDO, sheet Y2/SDO, sheet Z/SDO, port SPI_CONFIG.SPI_POCI  [project net SPI2_MISO]

Not connected (* = marked no-connect by the designer): J22 1* 2* 3* 4*; J23 1* 2* 3* 4*; J24 1* 2* 3* 4*; J25 1* 2* 3* 4*

### Notes on the sheet
- Stepper Drivers
- Expatria Technologies
- SHEET
- PROJECT
- REV
- EMAIL: INFO@EXPATRIA.CA
- 625 Kane Valley Rd.
- Box 2084
- Merritt, BC V1K1B8
- SIZE
- ENGR
- C
- MODIFIED
- DOCUMENT
- /
- Copyright Sienci Labs 2024. This document describes Open Hardware and is licensed under the CERN-OHL-S v2. No warranty is implied or expressed.

### Library data of the parts
J22-J25 = WJ2EDGK-5.08-4P: 4 1 5.08mm Green Plug P=5.08mm Pluggable System Terminal Block ROHS; Manufacturer: Ningbo; Manufacturer Part Number: WJ2EDGK-5.08-4P; SuppliersPartNumber: C71372; Supplier: LCSC; Value: WJ2EDGK-5.08-4P
P2-P5 = WJ2EDGVC-5.08-4P: 4 Straight pin 1 5.08mm Green Board Edge/Receptacle-Close Straight,P=5.08mm Pluggable System Terminal Block ROHS; Manufacturer: Ningbo Kangnex Elec; Supplier Part Number 1: C8436; Manufacturer Part Number: WJ2EDGVC-5.08-4P; RoHS: Yes; Category: Terminals; SuppliersPartNumber: C8436; Supplier 1: LCSC

## Sheet TMC2660_driver.SchDoc: RP2040 CNC
size B; Author: AM; CompanyName: Expatria Technologies; DrawnBy: A.Marles; Engineer: AM; Organization: Expatria Technolgoies; Address1: PO Box 2084; Address3: Merritt, BC V1K 1B8; Address4: Canada; DocumentNumber: 12; Revision: B6; SheetNumber: 9; SheetTotal: 26
Used 4 times, as channels Sienci CNC Controller/TMC2660C Stepper Drivers/X, Sienci CNC Controller/TMC2660C Stepper Drivers/Y1, Sienci CNC Controller/TMC2660C Stepper Drivers/Y2, Sienci CNC Controller/TMC2660C Stepper Drivers/Z. Parts and nets are listed once, with the designators drawn on the sheet.
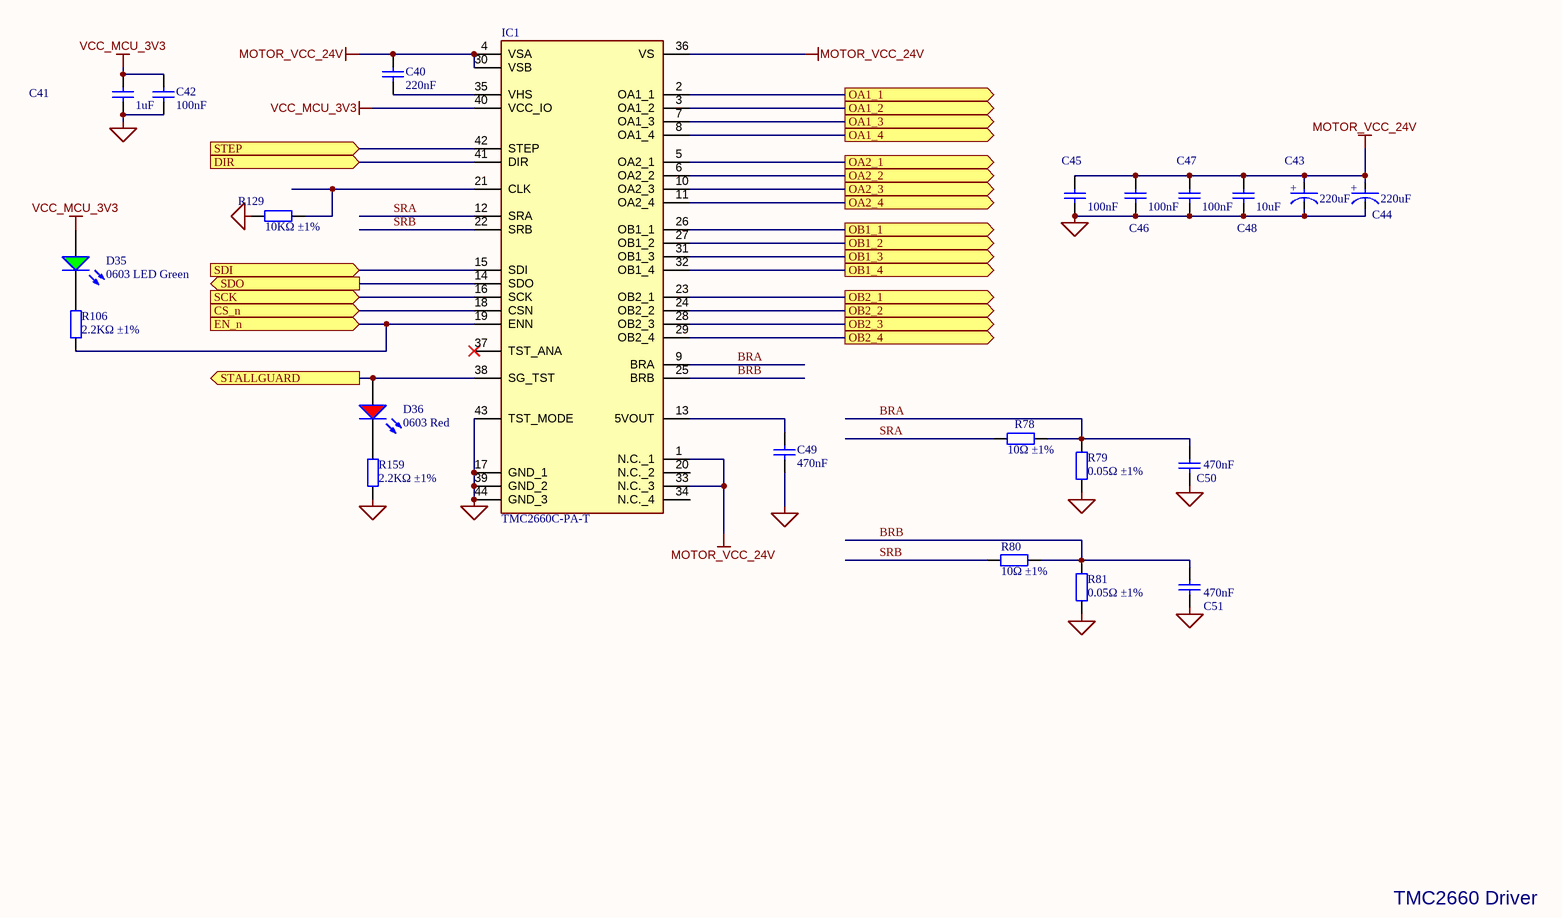
[diagram p15: TMC2660_driver.SchDoc]

### Parts
C40  220nF  [0603_C]
C41  1uF  [0603_C]
C42  100nF  [0603_C]
C43  220uF  [FP-FKG-MFG]
C44  220uF  [FP-FKG-MFG]
C45  100nF  [0603_C]
C46  100nF  [0603_C]
C47  100nF  [0603_C]
C48  10uF  [0805_C]
C49  470nF  [0603_C]
C50  470nF  [0603_C]
C51  470nF  [0603_C]
D35  0603 LED Green  [0603_LED_S1 - GREEN]
D36  0603 Red  [0603_LED_S1]
IC1  TMC2660C-PA-T  [QFP80P1200X1200X160-44N]
R78  10Ω ±1%  [0603_R]
R79  0.05Ω ±1%  [1206_R]
R80  10Ω ±1%  [0603_R]
R81  0.05Ω ±1%  [1206_R]
R106  2.2KΩ ±1%  [0402_R]
R129  10KΩ ±1%  [0603_R]
R159  2.2KΩ ±1%  [0402_R]

### Ports
CS_n (in), DIR (in), EN_n (in), OA1_1 (out), OA1_2 (out), OA1_3 (out), OA1_4 (out), OA2_1 (out), OA2_2 (out), OA2_3 (out), OA2_4 (out), OB1_1 (out), OB1_2 (out), OB1_3 (out), OB1_4 (out), OB2_1 (out), OB2_2 (out), OB2_3 (out), OB2_4 (out), SCK (in), SDI (in), SDO (out), STALLGUARD (out), STEP (in)

### Nets
MCU_GND: C41.1 C42.2 C43.1(C) C44.1(C) C45.2 C46.2 C47.2 C48.1 C49.1 C50.2 C51.2 IC1.17(GND_1) IC1.39(GND_2) IC1.43(TST_MODE) IC1.44(GND_3) R79.1 R81.1 R129.2 R159.1
MOTOR_VCC_24V: C40.2 C43.2(A) C44.2(A) C45.1 C46.1 C47.1 C48.2 IC1.1(N.C._1) IC1.4(VSA) IC1.30(VSB) IC1.33(N.C._3) IC1.36(VS)
VCC_MCU_3V3: C41.2 C42.1 D35.A IC1.40(VCC_IO)
BRA: C50.1 IC1.9(BRA) R78.2 R79.2
BRB: C51.1 IC1.25(BRB) R80.2 R81.2
CS_n: IC1.18(CSN) ; port CS_n
DIR: IC1.41(DIR) ; port DIR
EN_n: IC1.19(ENN) R106.1 ; port EN_n
OA1_1: IC1.2(OA1_1) ; port OA1_1
OA1_2: IC1.3(OA1_2) ; port OA1_2
OA1_3: IC1.7(OA1_3) ; port OA1_3
OA1_4: IC1.8(OA1_4) ; port OA1_4
OA2_1: IC1.5(OA2_1) ; port OA2_1
OA2_2: IC1.6(OA2_2) ; port OA2_2
OA2_3: IC1.10(OA2_3) ; port OA2_3
OA2_4: IC1.11(OA2_4) ; port OA2_4
OB1_1: IC1.26(OB1_1) ; port OB1_1
OB1_2: IC1.27(OB1_2) ; port OB1_2
OB1_3: IC1.31(OB1_3) ; port OB1_3
OB1_4: IC1.32(OB1_4) ; port OB1_4
OB2_1: IC1.23(OB2_1) ; port OB2_1
OB2_2: IC1.24(OB2_2) ; port OB2_2
OB2_3: IC1.28(OB2_3) ; port OB2_3
OB2_4: IC1.29(OB2_4) ; port OB2_4
SCK: IC1.16(SCK) ; port SCK
SDI: IC1.15(SDI) ; port SDI
SDO: IC1.14(SDO) ; port SDO
SRA: IC1.12(SRA) R78.1
SRB: IC1.22(SRB) R80.1
STALLGUARD: D36.A IC1.38(SG_TST) ; port STALLGUARD
STEP: IC1.42(STEP) ; port STEP
NetC40_1: C40.1 IC1.35(VHS)
NetC49_2: C49.2 IC1.13(5VOUT)
NetD35_K: D35.K R106.2
NetD36_K: D36.K R159.2
NetIC1_21: IC1.21(CLK) R129.1

Not connected (* = marked no-connect by the designer): IC1 20(N.C._2) 34(N.C._4) 37(TST_ANA)*

### Channels
Sienci CNC Controller/TMC2660C Stepper Drivers/X: designators end in _X; ports CS_n=CS_X DIR=DIR_X EN_n=STEP_EN_X OA1_1=OA1_1 OA1_2=OA1_1 OA1_3=OA1_1 OA1_4=OA1_1 OA2_1=OA2_1 OA2_2=OA2_1 OA2_3=OA2_1 OA2_4=OA2_1 OB1_1=OB1_1 OB1_2=OB1_1 OB1_3=OB1_1 OB1_4=OB1_1 OB2_1=OB2_1 OB2_2=OB2_1 OB2_3=OB2_1 OB2_4=OB2_1 SCK=SPI2_CK SDI=SPI2_MOSI SDO=SPI2_MISO STALLGUARD=SG_X STEP=STEP_X
Sienci CNC Controller/TMC2660C Stepper Drivers/Y1: designators end in _Y1; ports CS_n=CS_Y1 DIR=DIR_Y1 EN_n=STEP_EN_YY OA1_1=OA1_1 OA1_2=OA1_1 OA1_3=OA1_1 OA1_4=OA1_1 OA2_1=OA2_1 OA2_2=OA2_1 OA2_3=OA2_1 OA2_4=OA2_1 OB1_1=OB1_1 OB1_2=OB1_1 OB1_3=OB1_1 OB1_4=OB1_1 OB2_1=OB2_1 OB2_2=OB2_1 OB2_3=OB2_1 OB2_4=OB2_1 SCK=SPI2_CK SDI=SPI2_MOSI SDO=SPI2_MISO STALLGUARD=SG_Y1 STEP=STEP_Y1
Sienci CNC Controller/TMC2660C Stepper Drivers/Y2: designators end in _Y2; ports CS_n=CS_Y2 DIR=DIR_Y2 EN_n=STEP_EN_YY OA1_1=OA1_1 OA1_2=OA1_1 OA1_3=OA1_1 OA1_4=OA1_1 OA2_1=OA2_1 OA2_2=OA2_1 OA2_3=OA2_1 OA2_4=OA2_1 OB1_1=OB1_1 OB1_2=OB1_1 OB1_3=OB1_1 OB1_4=OB1_1 OB2_1=OB2_1 OB2_2=OB2_1 OB2_3=OB2_1 OB2_4=OB2_1 SCK=SPI2_CK SDI=SPI2_MOSI SDO=SPI2_MISO STALLGUARD=SG_Y2 STEP=STEP_Y2
Sienci CNC Controller/TMC2660C Stepper Drivers/Z: designators end in _Z; ports CS_n=CS_Z DIR=DIR_Z EN_n=STEP_EN_Z OA1_1=OA1_1 OA1_2=OA1_1 OA1_3=OA1_1 OA1_4=OA1_1 OA2_1=OA2_1 OA2_2=OA2_1 OA2_3=OA2_1 OA2_4=OA2_1 OB1_1=OB1_1 OB1_2=OB1_1 OB1_3=OB1_1 OB1_4=OB1_1 OB2_1=OB2_1 OB2_2=OB2_1 OB2_3=OB2_1 OB2_4=OB2_1 SCK=SPI2_CK SDI=SPI2_MOSI SDO=SPI2_MISO STALLGUARD=SG_Z STEP=STEP_Z

### Notes on the sheet
- TMC2660 Driver
- SHEET
- Expatria Technologies
- 625 Kane Valley Rd.
- Box 2084
- Merritt, BC V1K1B8
- PROJECT
- SIZE
- ENGR
- MODIFIED
- DOCUMENT
- REV
- Copyright Sienci Labs 2024. This document describes Open Hardware and is licensed under the CERN-OHL-S v2. No warranty is implied or expressed.
- EMAIL: INFO@EXPATRIA.CA
- B
- /
- (in symbol UUD1H221MNL1GS) +

### Library data of the parts
C40 = 0603 220nF (224) 10% 25V: Chip capacitors; Manufacturer: Samsung Electro-Mechanics; Manufacturer Part Number: CL10B224KA8NNNC; Tolerance: 10%; Voltage: 25V; ComponentLink1Description: Supplier link; ComponentLink1URL: http://www.szlcsc.com/product/details_21832.html; Package: 0603; Supplier: LCSC; SuppliersPartNumber: C21120; Capacitance: 220nF
C41 = 0603 1uF (105) 10% 50V: as C9 on sheet RS485; ComponentLink1Description: Supplier link; ComponentLink1URL: http://www.szlcsc.com/product/details_16531.html; Package: 0603; Supplier: LCSC; SuppliersPartNumber: C15849; Capacitance: 1uF
C42 C45-C47 = 0603 100nF (104) 10% 50V: as C4 on sheet Spindle_Control; ComponentLink1Description: Supplier link; ComponentLink1URL: http://www.szlcsc.com/product/details_15331.html; Package: 0603; Supplier: LC; SuppliersPartNumber: C14663; Capacitance: 100nF; Tolerance: 10%; Voltage: 50V
C43 C44 = UUD1H221MNL1GS: CAP ALUM 220UF 20% 50V SMD; Manufacturer: Nichicon; Material: Aluminum; Life: 2000Hours; Esr: 0.18Ω; Automotive Grade: Grade 2; Dissipation Factor: 10%; Tolerance: 20%; Device Class L3: Aluminum Electrolytic Capacitors; ComponentLink2Description: Datasheet; Temperature Range High: +105°C; Digikey Description: CAP ALUM 220UF 20% 50V SMD; Height: 10.5mm; Voltage Rating: 50V; Value: 220uF; Capacitance: 220uF; Automotive: Yes; ComponentLink2URL: https://industrial.panasonic.com/cdbs/www-data/pdf/RDE0000/ABA0000C1181.pdf; Package: FKG; Device Class L2: Capacitors; Lead Free: Yes; Device Class L1: Passive Components; Manufacturer Part Number: UUD1H221MNL1GS; SuppliersPartNumber: C125976; Supplier: LCSC
C48 = 0805 10uF (106) 10% 25V: Chip capacitors; Manufacturer: Samsung Electro-Mechanics; Manufacturer Part Number: CL21A106KAYNNNE; Tolerance: 10%; Voltage: 25V; ComponentLink1Description: Supplier link; ComponentLink1URL: http://www.szlcsc.com/product/details_16532.html; Package: 0805; Supplier: LCSC; SuppliersPartNumber: C15850; Capacitance: 10uF
C49-C51 = 0603 470nF (474) 10% 25V: Chip capacitors; Manufacturer: Samsung Electro-Mechanics; Manufacturer Part Number: CL10B474KA8NNNC; Tolerance: 10%; Voltage: 25V; ComponentLink1Description: Supplier link; ComponentLink1URL: http://www.szlcsc.com/product/details_1975.html; Package: 0603; SuppliersPartNumber: C1623; Capacitance: 470nF
  C49: Supplier: LCSC
  C50 C51: Supplier: LC
D35 = 19-217/GHC-YR1S2/3T: as D18 on sheet RS485; Package: 0603; Supplier: LC; SuppliersPartNumber: C72043; Color: Green; Manufacturer Part Number: 19-217/GHC-YR1S2/3T
D36 = 19-213SURC/S530-A3/TR8: as D13 on sheet Misc_switches; Package: 0603; Supplier: LC; SuppliersPartNumber: C72039; Color: Red; ComponentLink1Description: 供应商链接; ComponentLink1URL: http://www.szlcsc.com/product/details_2659.html; Supplier 1: LC; Supplier Part Number 1: C72039; Manufacturer Part Number: 19-213SURC/S530-A3/TR8
IC1 = TMC2660C-PA-T: QFP-44 Motor Driver ICs ROHS; Manufacturer_Name: TRINAMIC; Manufacturer_Part_Number: TMC2660C-PA-T; SuppliersPartNumber: C2927052; Supplier: LCSC; Manufacturer: TRINAMIC; Manufacturer Part Number: TMC2660C-PA-T
R78 R80 = 0603 10R (10R0) 1%: Chip resistor; Manufacturer: Uniroyal Elec; Manufacturer Part Number: 0603WAF100JT5E; Power: 1/10W; ComponentLink1Description: Supplier link; ComponentLink1URL: http://www.szlcsc.com/product/details_23586.html; Package: 0603; Supplier: LCSC; SuppliersPartNumber: C22859; Resistance: 10Ω; Tolerance: 1%
R79 R81 = 1206 0.05R (R50) 1%: 1W ±100ppm/℃ ±1% 50mΩ 1206 Chip Resistor - Surface Mount ROHS; Manufacturer: YAGEO; Manufacturer Part Number: PA1206FRF470R05L; Resistance: 0.05; ComponentLink1Description: Supplier link; ComponentLink1URL: http://www.szlcsc.com/product/details_26077.html; Package: 1206; Supplier: LC; SuppliersPartNumber: C728294; Power: 1W; Tolerance: 1%
R106 R159 = 0402 2.2K (2201) 1%: Chip resistor; Manufacturer: Uniroyal Elec; Manufacturer Part Number: 0402WGF2201TCE; Power: 1/16W; ComponentLink1Description: Supplier link; ComponentLink1URL: http://www.szlcsc.com/product/details_26622.html; Package: 0402; Supplier: LC; SuppliersPartNumber: C25879; Resistance: 2.2KΩ; Tolerance: 1%
R129 = 0603 10K (1002) 1%: as R55 on sheet 5V_Power_Supply; Package: 0603; Supplier: LCSC; SuppliersPartNumber: C25804; Resistance: 10KΩ; Tolerance: 1%; ComponentLink1Description: Supplier link; ComponentLink1URL: http://www.szlcsc.com/product/details_26547.html

## Sheet Aux_Outputs.SchDoc: RP2040 CNC
size B; Author: AM; CompanyName: Expatria Technologies; DrawnBy: A.Marles; Engineer: AM; Organization: Expatria Technolgoies; Address1: PO Box 2084; Address3: Merritt, BC V1K 1B8; Address4: Canada; DocumentNumber: 13; Revision: B6; SheetNumber: 10; SheetTotal: 26
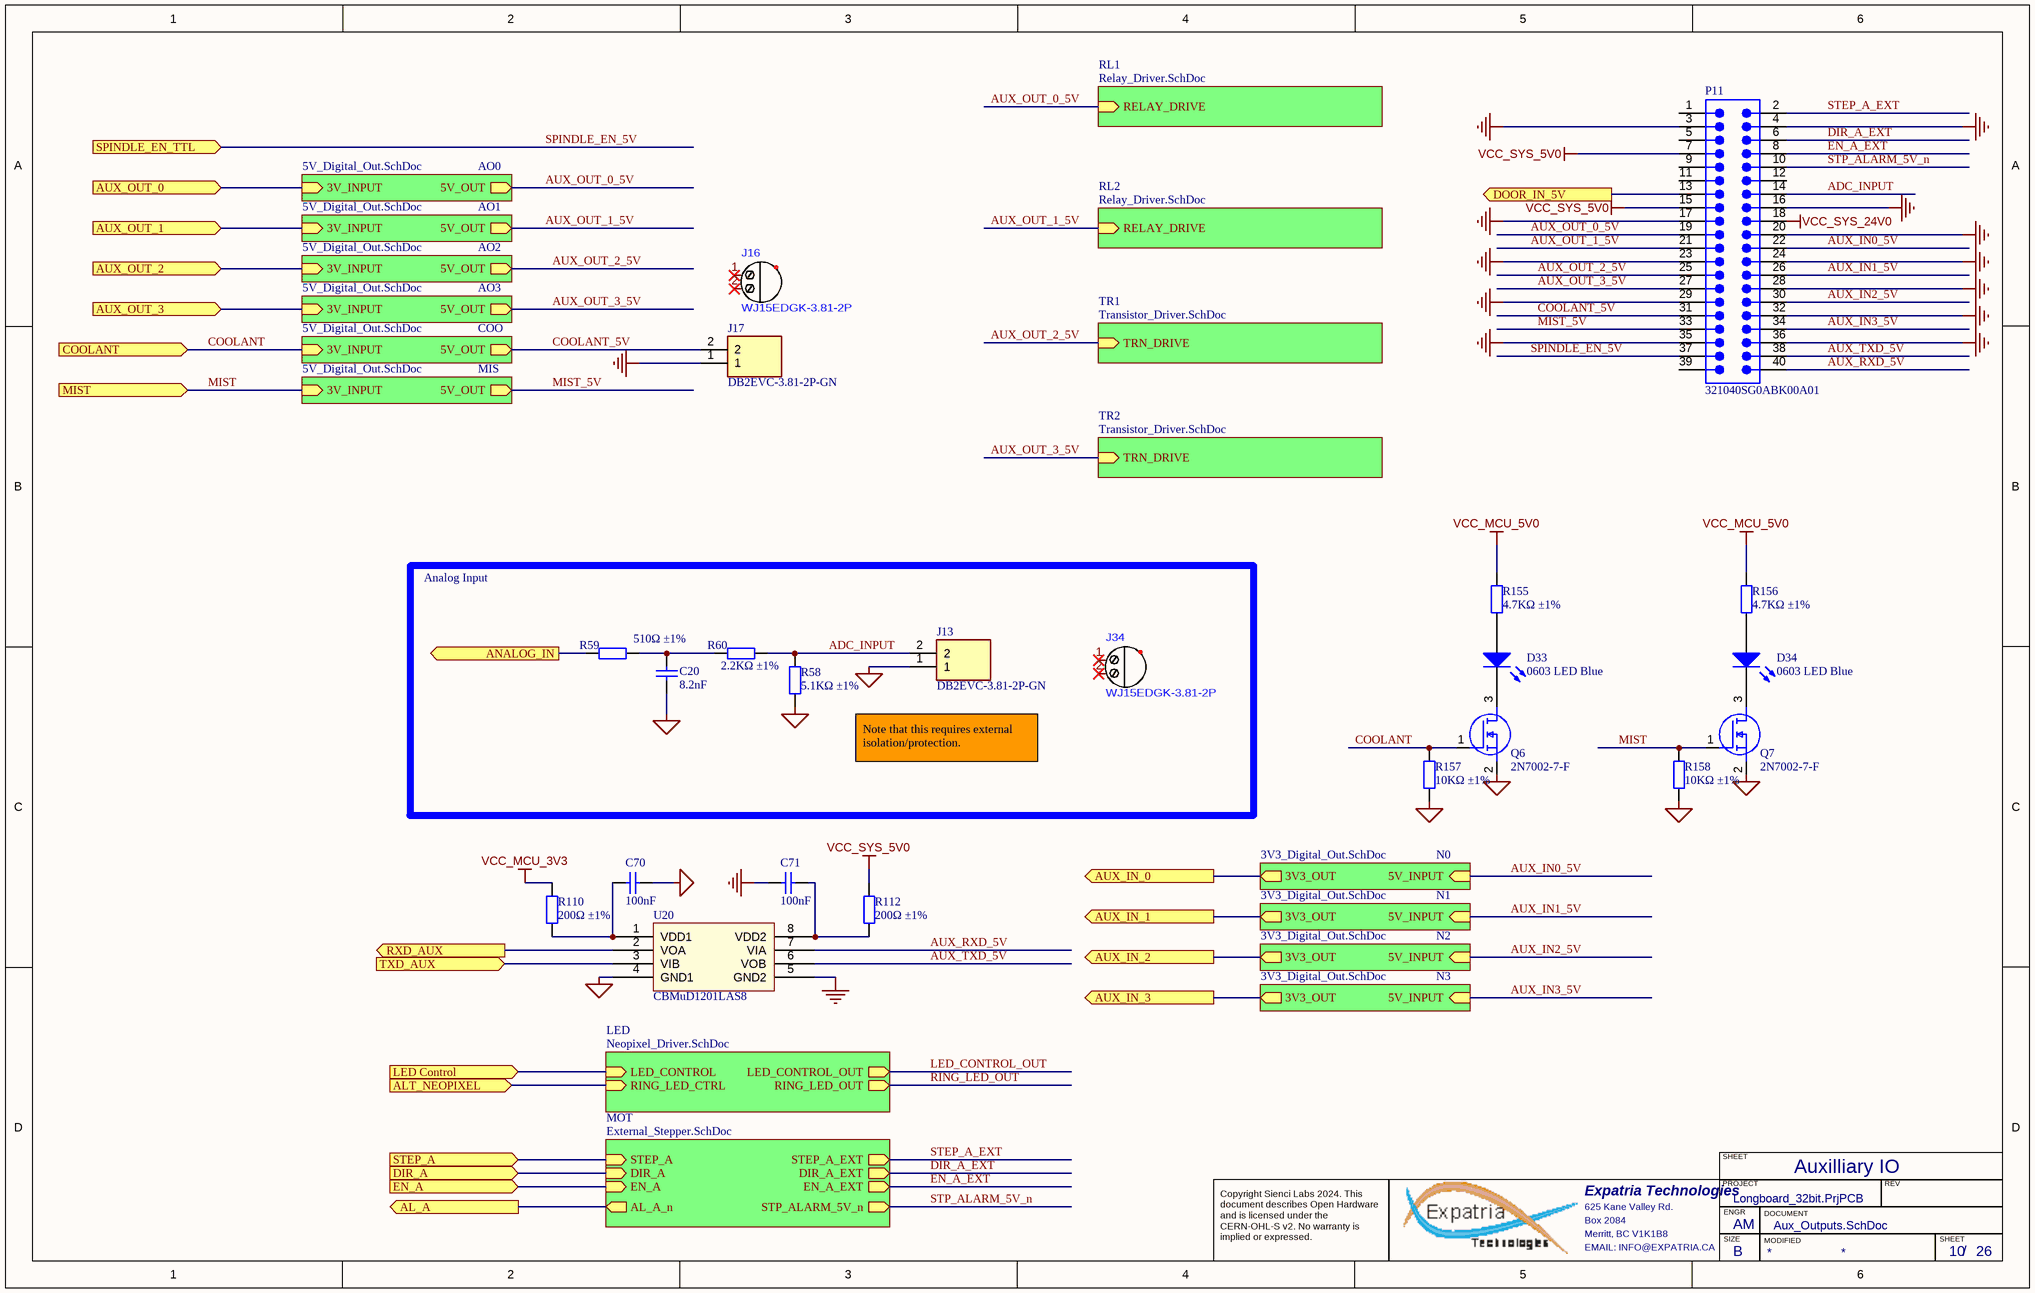
[diagram p16: Aux_Outputs.SchDoc]

### Parts
C20  8.2nF  [0603_C]
C70  100nF  [0402_C]
C71  100nF  [0402_C]
D33  0603 LED Blue  [0603_LED_S1 - BLUE]
D34  0603 LED Blue  [0603_LED_S1 - BLUE]
J13  DB2EVC-3.81-2P-GN  [CONN-TH_5P-P3.81_DB2EVC-3.81-2p]
J16  WJ15EDGK-3.81-2P  (mechanical)
J17  DB2EVC-3.81-2P-GN  [CONN-TH_5P-P3.81_DB2EVC-3.81-2p]
J34  WJ15EDGK-3.81-2P  (mechanical)
P11  321040SG0ABK00A01  [IDC-TH_40P-P2.54_321040SG0ABK00A01]
Q6  2N7002-7-F  [SOT-23(SOT-23-3)]
Q7  2N7002-7-F  [SOT-23(SOT-23-3)]
R58  5.1KΩ ±1%  [0402_R]
R59  510Ω ±1%  [0402_R]
R60  2.2KΩ ±1%  [0402_R]
R110  200Ω ±1%  [0402_R]
R112  200Ω ±1%  [0402_R]
R155  4.7KΩ ±1%  [0402_R]
R156  4.7KΩ ±1%  [0402_R]
R157  10KΩ ±1%  [0603_R]
R158  10KΩ ±1%  [0603_R]
U20  CBMuD1201LAS8  [SOIC-8_150mil]

### Blocks framed on the sheet
Analog Input: C20 J13 J34 R58-R60

### Sub-sheets
AO0 = 5V_Digital_Out.SchDoc: 5V_OUT (out), 3V_INPUT (in)
AO1 = 5V_Digital_Out.SchDoc: 5V_OUT (out), 3V_INPUT (in)
AO2 = 5V_Digital_Out.SchDoc: 5V_OUT (out), 3V_INPUT (in)
AO3 = 5V_Digital_Out.SchDoc: 5V_OUT (out), 3V_INPUT (in)
COO = 5V_Digital_Out.SchDoc: 5V_OUT (out), 3V_INPUT (in)
LED = Neopixel_Driver.SchDoc: LED_CONTROL (in), LED_CONTROL_OUT (out), RING_LED_OUT (out), RING_LED_CTRL (in)
MIS = 5V_Digital_Out.SchDoc: 5V_OUT (out), 3V_INPUT (in)
MOT = External_Stepper.SchDoc: STEP_A (in), EN_A (in), AL_A_n (out), DIR_A (in), EN_A_EXT (out), DIR_A_EXT (out), STP_ALARM_5V_n (out), STEP_A_EXT (out)
N0 = 3V3_Digital_Out.SchDoc: 3V3_OUT (out), 5V_INPUT (in)
N1 = 3V3_Digital_Out.SchDoc: 3V3_OUT (out), 5V_INPUT (in)
N2 = 3V3_Digital_Out.SchDoc: 3V3_OUT (out), 5V_INPUT (in)
N3 = 3V3_Digital_Out.SchDoc: 3V3_OUT (out), 5V_INPUT (in)
RL1 = Relay_Driver.SchDoc: RELAY_DRIVE (in)
RL2 = Relay_Driver.SchDoc: RELAY_DRIVE (in)
TR1 = Transistor_Driver.SchDoc: TRN_DRIVE (in)
TR2 = Transistor_Driver.SchDoc: TRN_DRIVE (in)

### Ports
AL_A (out), ALT_NEOPIXEL (in), ANALOG_IN (out), AUX_IN_0 (out), AUX_IN_1 (out), AUX_IN_2 (out), AUX_IN_3 (out), AUX_OUT_0 (in), AUX_OUT_1 (in), AUX_OUT_2 (in), AUX_OUT_3 (in), COOLANT (in), DIR_A (in), DOOR_IN_5V (out), EN_A (in), LED Control (in), MIST (in), RXD_AUX (out), SPINDLE_EN_TTL (in), STEP_A (in), TXD_AUX (in)

### Nets
GND: C71.1 J17.1 P11.3 P11.4 P11.16 P11.17 P11.20 P11.23 P11.24 P11.28 P11.29 P11.32 P11.35 P11.36 U20.5(GND2)
MCU_GND: C20.1 C70.2 J13.1 Q6.2(S) Q7.2(S) R58.1 R157.1 R158.1 U20.4(GND1)
VCC_MCU_3V3: R110.1
VCC_MCU_5V0: R155.2 R156.2
VCC_SYS_5V0: P11.7 P11.15 R112.1
VCC_SYS_24V0: P11.18
ADC_INPUT: J13.2 P11.14 R58.2 R60.2
AL_A: port AL_A, sheet MOT/AL_A_n
ANALOG_IN: R59.1 ; port ANALOG_IN
AUX_IN0_5V: P11.22 ; sheet N0/5V_INPUT
AUX_IN1_5V: P11.26 ; sheet N1/5V_INPUT
AUX_IN2_5V: P11.30 ; sheet N2/5V_INPUT
AUX_IN3_5V: P11.34 ; sheet N3/5V_INPUT
AUX_IN_0: port AUX_IN_0, sheet N0/3V3_OUT
AUX_IN_1: port AUX_IN_1, sheet N1/3V3_OUT
AUX_IN_2: port AUX_IN_2, sheet N2/3V3_OUT
AUX_IN_3: port AUX_IN_3, sheet N3/3V3_OUT
AUX_OUT_0_5V: P11.19 ; sheet RL1/RELAY_DRIVE, sheet AO0/5V_OUT
AUX_OUT_1_5V: P11.21 ; sheet RL2/RELAY_DRIVE, sheet AO1/5V_OUT
AUX_OUT_2_5V: P11.25 ; sheet TR1/TRN_DRIVE, sheet AO2/5V_OUT
AUX_OUT_3_5V: P11.27 ; sheet AO3/5V_OUT, sheet TR2/TRN_DRIVE
AUX_RXD_5V: P11.40 U20.7(VIA)
AUX_TXD_5V: P11.38 U20.6(VOB)
AUXOUT_0: port AUX_OUT_0, sheet AO0/3V_INPUT
AUXOUT_1: port AUX_OUT_1, sheet AO1/3V_INPUT
AUXOUT_2: port AUX_OUT_2, sheet AO2/3V_INPUT
AUXOUT_3: port AUX_OUT_3, sheet AO3/3V_INPUT
COOLANT: Q6.1(G) R157.2 ; port COOLANT, sheet COO/3V_INPUT
COOLANT_5V: J17.2 P11.31 ; sheet COO/5V_OUT
DIR_A: port DIR_A, sheet MOT/DIR_A
DIR_A_EXT: P11.6 ; sheet MOT/DIR_A_EXT
DOOR_IN_5V: P11.13 ; port DOOR_IN_5V
EN_A_EXT: P11.8 ; sheet MOT/EN_A_EXT
LED Control: port LED Control, sheet LED/LED_CONTROL
MIST: Q7.1(G) R158.2 ; port MIST, sheet MIS/3V_INPUT
MIST_5V: P11.33 ; sheet MIS/5V_OUT
RXD_AUX: U20.2(VOA) ; port RXD_AUX
SPINDLE_EN_5V: P11.37 ; port SPINDLE_EN_TTL
STEP_A: port STEP_A, sheet MOT/STEP_A
STEP_A_EXT: P11.2 ; sheet MOT/STEP_A_EXT
STEP_EN_A: port EN_A, sheet MOT/EN_A
STP_ALARM_5V_n: P11.10 ; sheet MOT/STP_ALARM_5V_n
SWDIO: port ALT_NEOPIXEL, sheet LED/RING_LED_CTRL
TXD_AUX: U20.3(VIB) ; port TXD_AUX
NetC20_2: C20.2 R59.2 R60.1
NetC70_1: C70.1 R110.2 U20.1(VDD1)
NetC71_2: C71.2 R112.2 U20.8(VDD2)
NetD33_A: D33.A R155.1
NetD33_K: D33.K Q6.3(D)
NetD34_A: D34.A R156.1
NetD34_K: D34.K Q7.3(D)

Not connected (* = marked no-connect by the designer): J16 1* 2*; J34 1* 2*; P11 1 5 9 11 12 39

### Notes on the sheet
- Note that this requires external isolation/protection.
- Auxilliary IO
- SHEET
- Expatria Technologies
- 625 Kane Valley Rd.
- Box 2084
- Merritt, BC V1K1B8
- PROJECT
- SIZE
- ENGR
- MODIFIED
- DOCUMENT
- REV
- Copyright Sienci Labs 2024. This document describes Open Hardware and is licensed under the CERN-OHL-S v2. No warranty is implied or expressed.
- EMAIL: INFO@EXPATRIA.CA
- B
- /

### Library data of the parts
C20 = 0603 8.2nF (822) 10% 50V: as C18 on sheet 5V_Power_Supply; Package: 0603; Supplier: LC; SuppliersPartNumber: C113812; Capacitance: 8.2nF; Tolerance: 10%; Voltage: 50V; Manufacturer 1: YAGEO; Manufacturer Part Number 1: CC0603KRX7R9BB822; Value: 8.2nF
C70 C71 = 0402 100nF (104) 10% 16V: as C73 on sheet Spindle_Control; ComponentLink1Description: Supplier link; ComponentLink1URL: http://www.szlcsc.com/product/details_1877.html; Package: 0402; Supplier: LC; SuppliersPartNumber: C1525; Capacitance: 100nF; Tolerance: 10%; Voltage: 16V
D33 D34 = 0603 LED Blue: Colorless transparence -40℃~+85℃ 465nm~475nm blue 120° 110mW 0603 Light Emitting Diodes (LED) ROHS; Manufacturer: Everlight Elec; Manufacturer Part Number: 19-217/BHC-ZL1M2RY/3T; Package: 0603; Supplier: LC; SuppliersPartNumber: C72041; Color: Blue
J13 J17 = DB2EVC-3.81-2P-GN: 3.81mm Green Board Edge/Receptacle-Close Push-Pull,P=3.81mm Pluggable System Terminal Block ROHS; Manufacturer: DIBO; Manufacturer Part Number: DB2EVC-3.81-2P-GN; SuppliersPartNumber: C395686; Supplier: LCSC; Value: DB2EVC-3.81-2P-GN
J16 J34 = WJ15EDGK-3.81-2P: 2 1 3.81mm Green Plug P=3.81mm Pluggable System Terminal Block ROHS; Manufacturer: Ningbo; Supplier: LCSC; Supplier Part Number 1: C8466; Manufacturer Part Number: WJ15EDGK-3.81-2P; RoHS: Yes; SuppliersPartNumber: C8466
P11 = 321040SG0ABK00A01: 2.54mm Straight Gold Brass 20 Push - Pull 2.54mm 2 Straight,P=2.54mm IDC Connectors ROHS; Manufacturer: JILN; SuppliersPartNumber: C601944; Supplier: LCSC; Manufacturer Part Number: 321040SG0ABK00A01
Q6 Q7 = 2N7002-7-F: as Q4 on sheet Spindle_Control; SuppliersPartNumber: C85049; Manufacturer Part Number: 2N7002-7-F; Value: 2N7002-7-F; Datasheet Link: https://datasheet.datasheetarchive.com/originals/distributors/SFDatasheet-0/sf-0003625.pdf; Height: 1.2mm; Manufacturer_Part_Number: 2N7002-7-F; Mouser Part Number: 621-2N7002-F; Mouser Price/Stock: https://www.mouser.co.uk/ProductDetail/Diodes-Incorporated/2N7002-7-F?qs=jMXWnm70%252BC%252BAX%252BMLzUkTZg%3D%3D; Arrow Part Number: 2N7002-7-F; Arrow Price/Stock: https://www.arrow.com/en/products/2n7002-7-f/diodes-incorporated?region=nac
R58 = 0402 5.1K (5101) 1%: Chip resistor; Manufacturer: Uniroyal Elec; Manufacturer Part Number: 0402WGF5101TCE; Power: 1/16W; Resistance: 51.1KΩ; ComponentLink1Description: Supplier link; ComponentLink1URL: http://www.szlcsc.com/product/details_26648.html; Package: 0402; Supplier: LCSC; SuppliersPartNumber: C25905; Tolerance: 1%
R59 = 0402 510R (5100) 1%: as R165 on sheet Spindle_Control; Package: 0402; Supplier: LC; SuppliersPartNumber: C25123; Resistance: 510Ω; Tolerance: 1%
R60 = 0402 2.2K (2201) 1%: as R106 on sheet TMC2660_driver; ComponentLink1Description: Supplier link; ComponentLink1URL: http://www.szlcsc.com/product/details_26622.html; Package: 0402; Supplier: LCSC; SuppliersPartNumber: C25879; Resistance: 2.2KΩ; Tolerance: 1%
R110 R112 = 0402 200R (2000) 1%: as R44 on sheet RS485; Package: 0402; Supplier: LC; SuppliersPartNumber: C25087; Resistance: 200Ω; Tolerance: 1%; ComponentLink1Description: Supplier link; ComponentLink1URL: http://www.szlcsc.com/product/details_25830.html
R155 R156 = 0402 4.7K (4701) 1%: as R151 on sheet Spindle_Control; ComponentLink1Description: Supplier link; ComponentLink1URL: http://www.szlcsc.com/product/details_26643.html; Package: 0402; Supplier: LCSC; SuppliersPartNumber: C25900; Resistance: 4.7KΩ; Tolerance: 1%
R157 R158 = 0603 10K (1002) 1%: as R55 on sheet 5V_Power_Supply; Package: 0603; Supplier: LCSC; SuppliersPartNumber: C25804; Resistance: 10KΩ; Tolerance: 1%; ComponentLink1Description: Supplier link; ComponentLink1URL: http://www.szlcsc.com/product/details_26547.html
U20 = CBMuD1201LAS8: as U12 on sheet RS485; Package: SOIC-8_150mil; Supplier: LC; SuppliersPartNumber: C476472; ComponentLink1Description: 供应商链接; ComponentLink1URL: http://www.szlcsc.com/product/details_10199.html; Manufacturer Part Number: CBMuD1201LAS8